# EAGLE schematic retrostoneH3-18 (EAGLE 7.6.0)

## Sheet 1 of 2
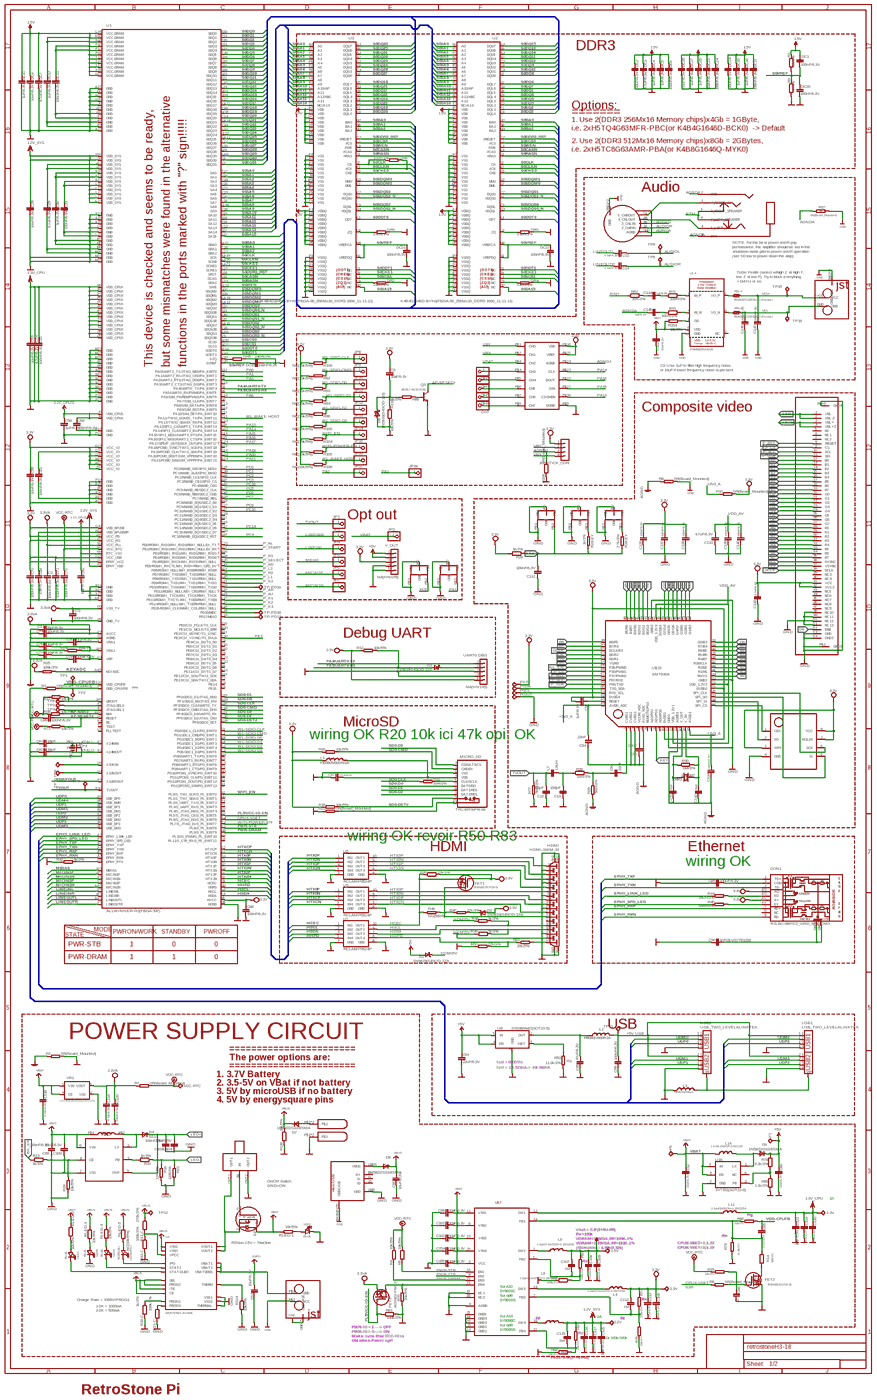
[diagram p0: schematic, sheet 1, overview]
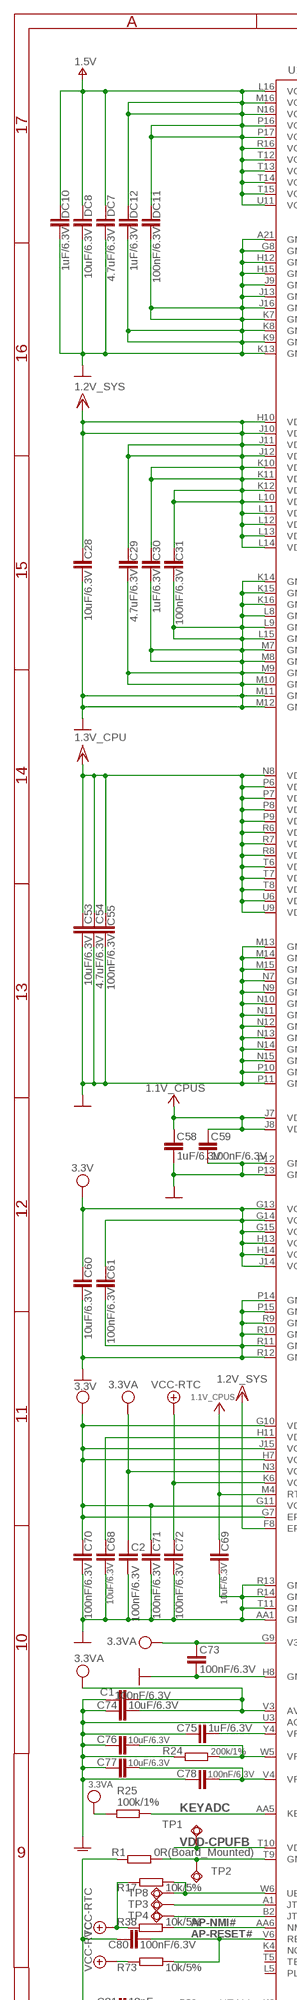
[diagram p1: schematic, sheet 1, part 1 of 4]
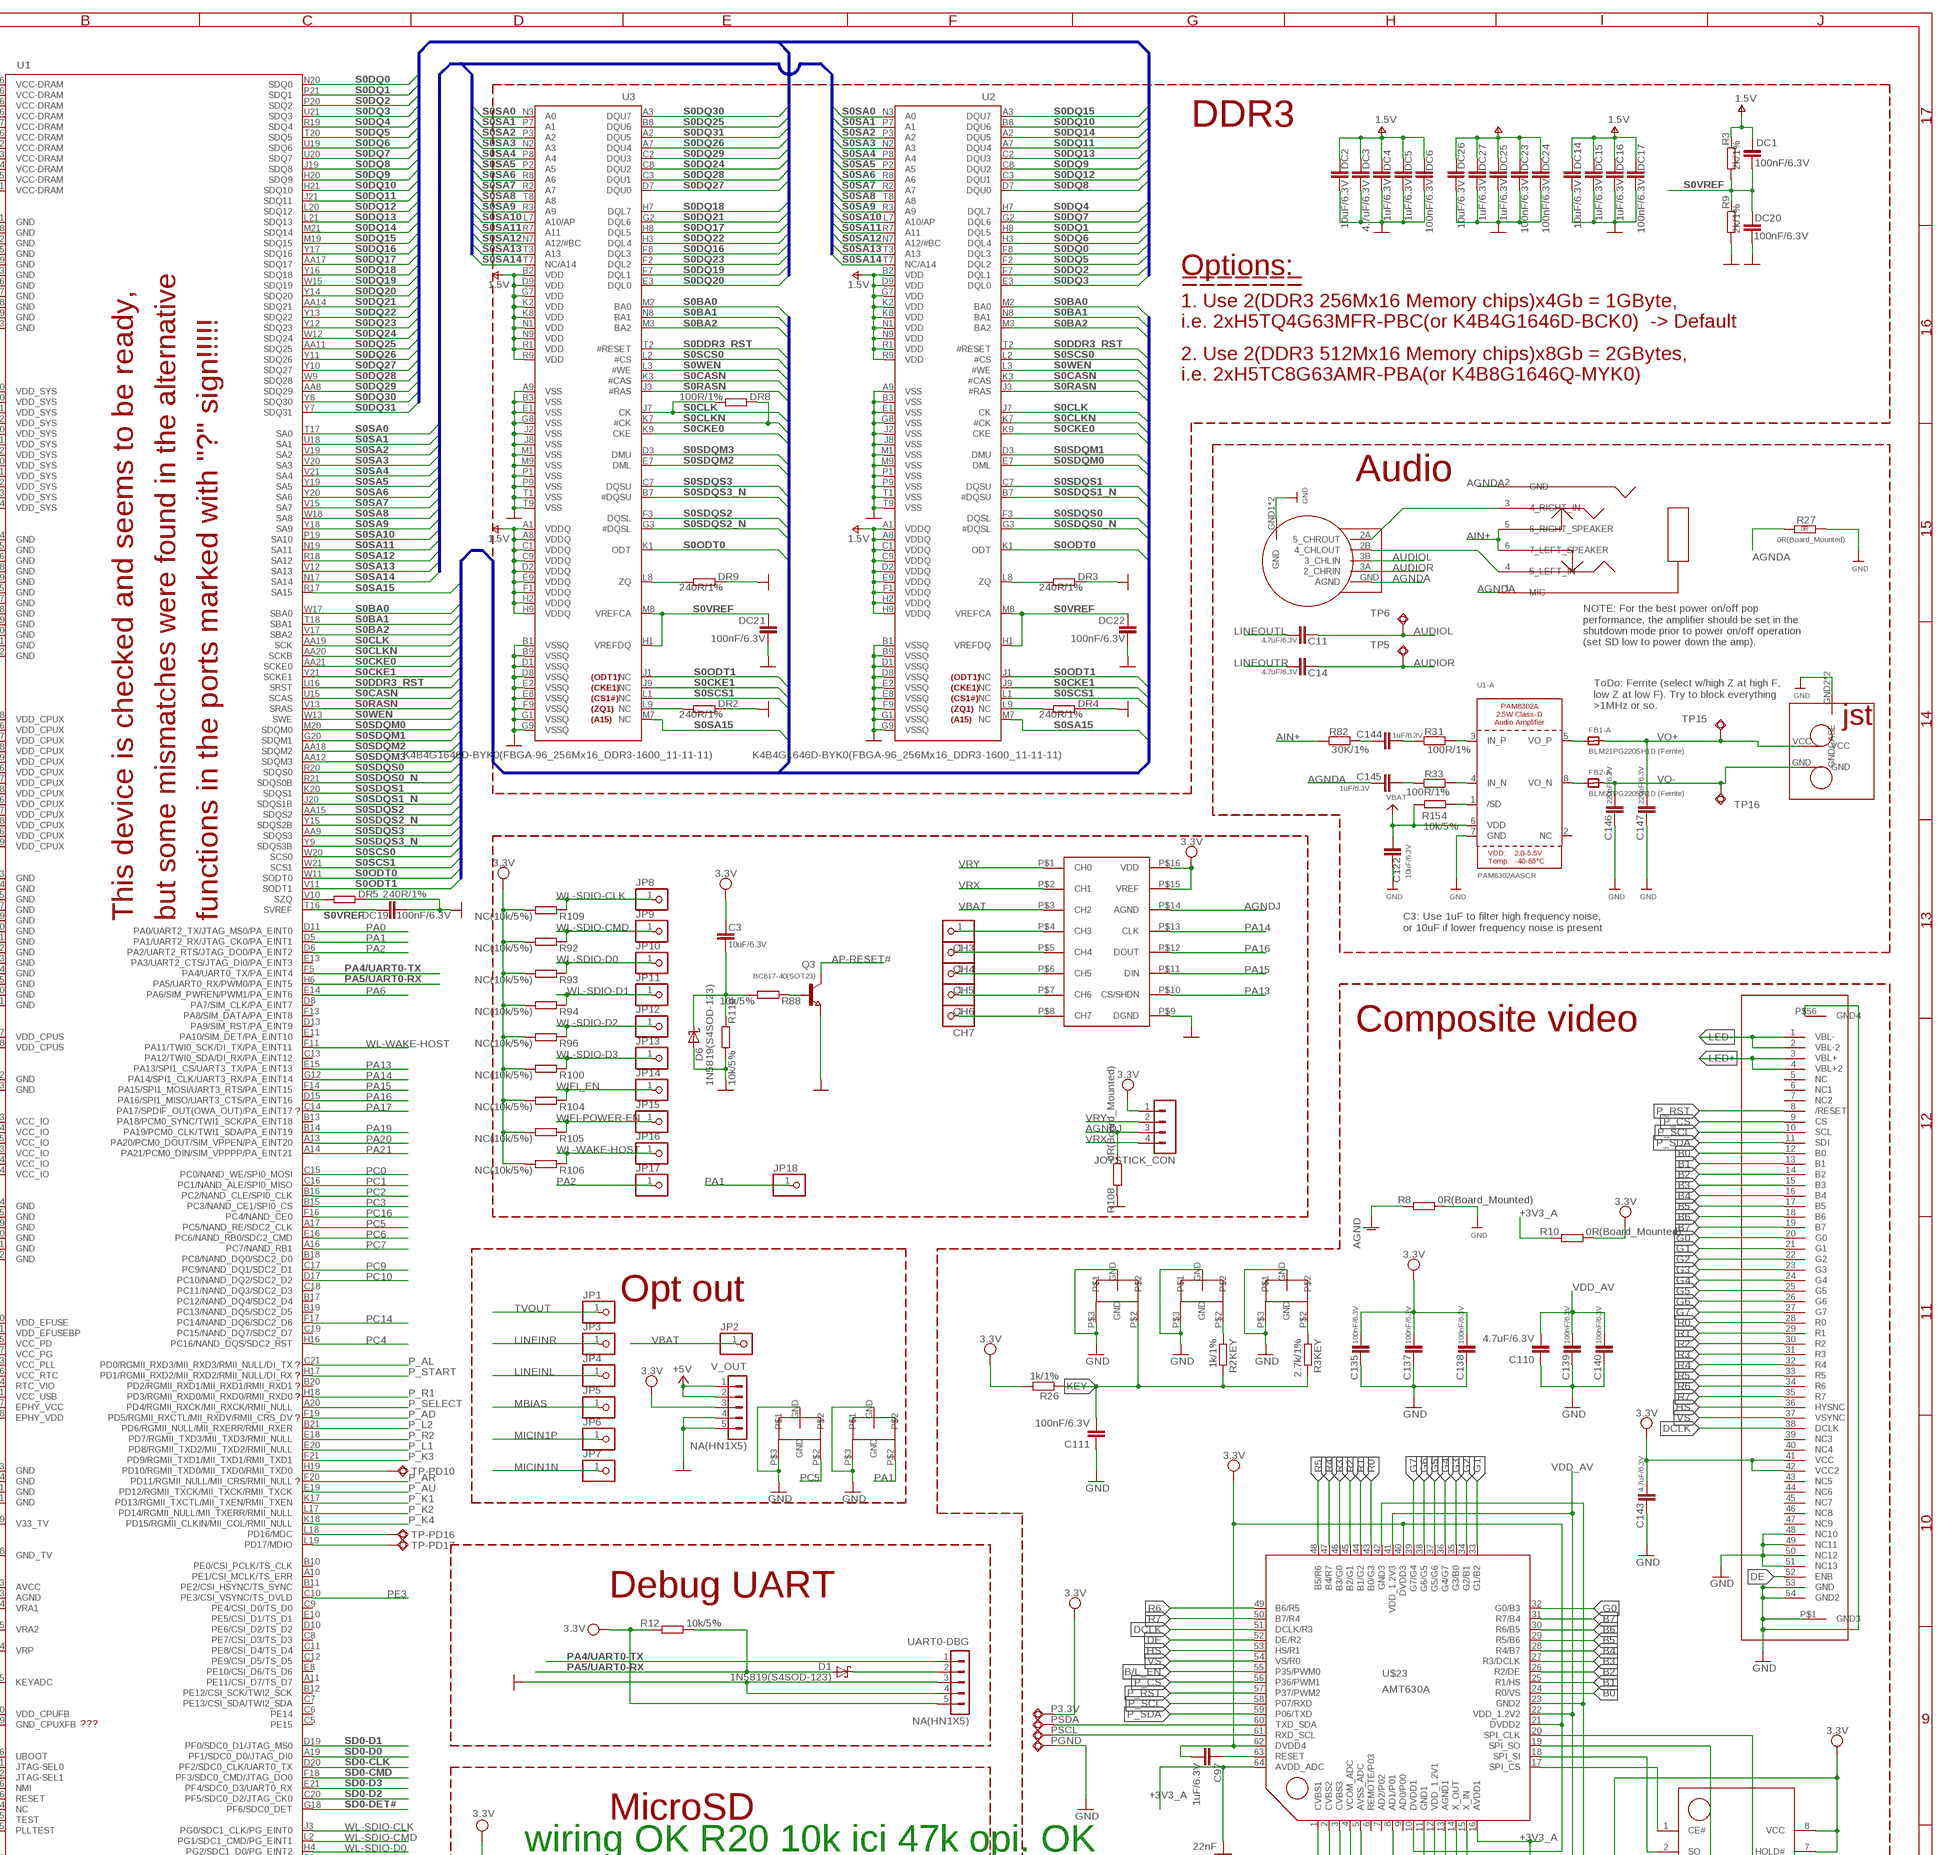
[diagram p2: schematic, sheet 1, part 2 of 4]
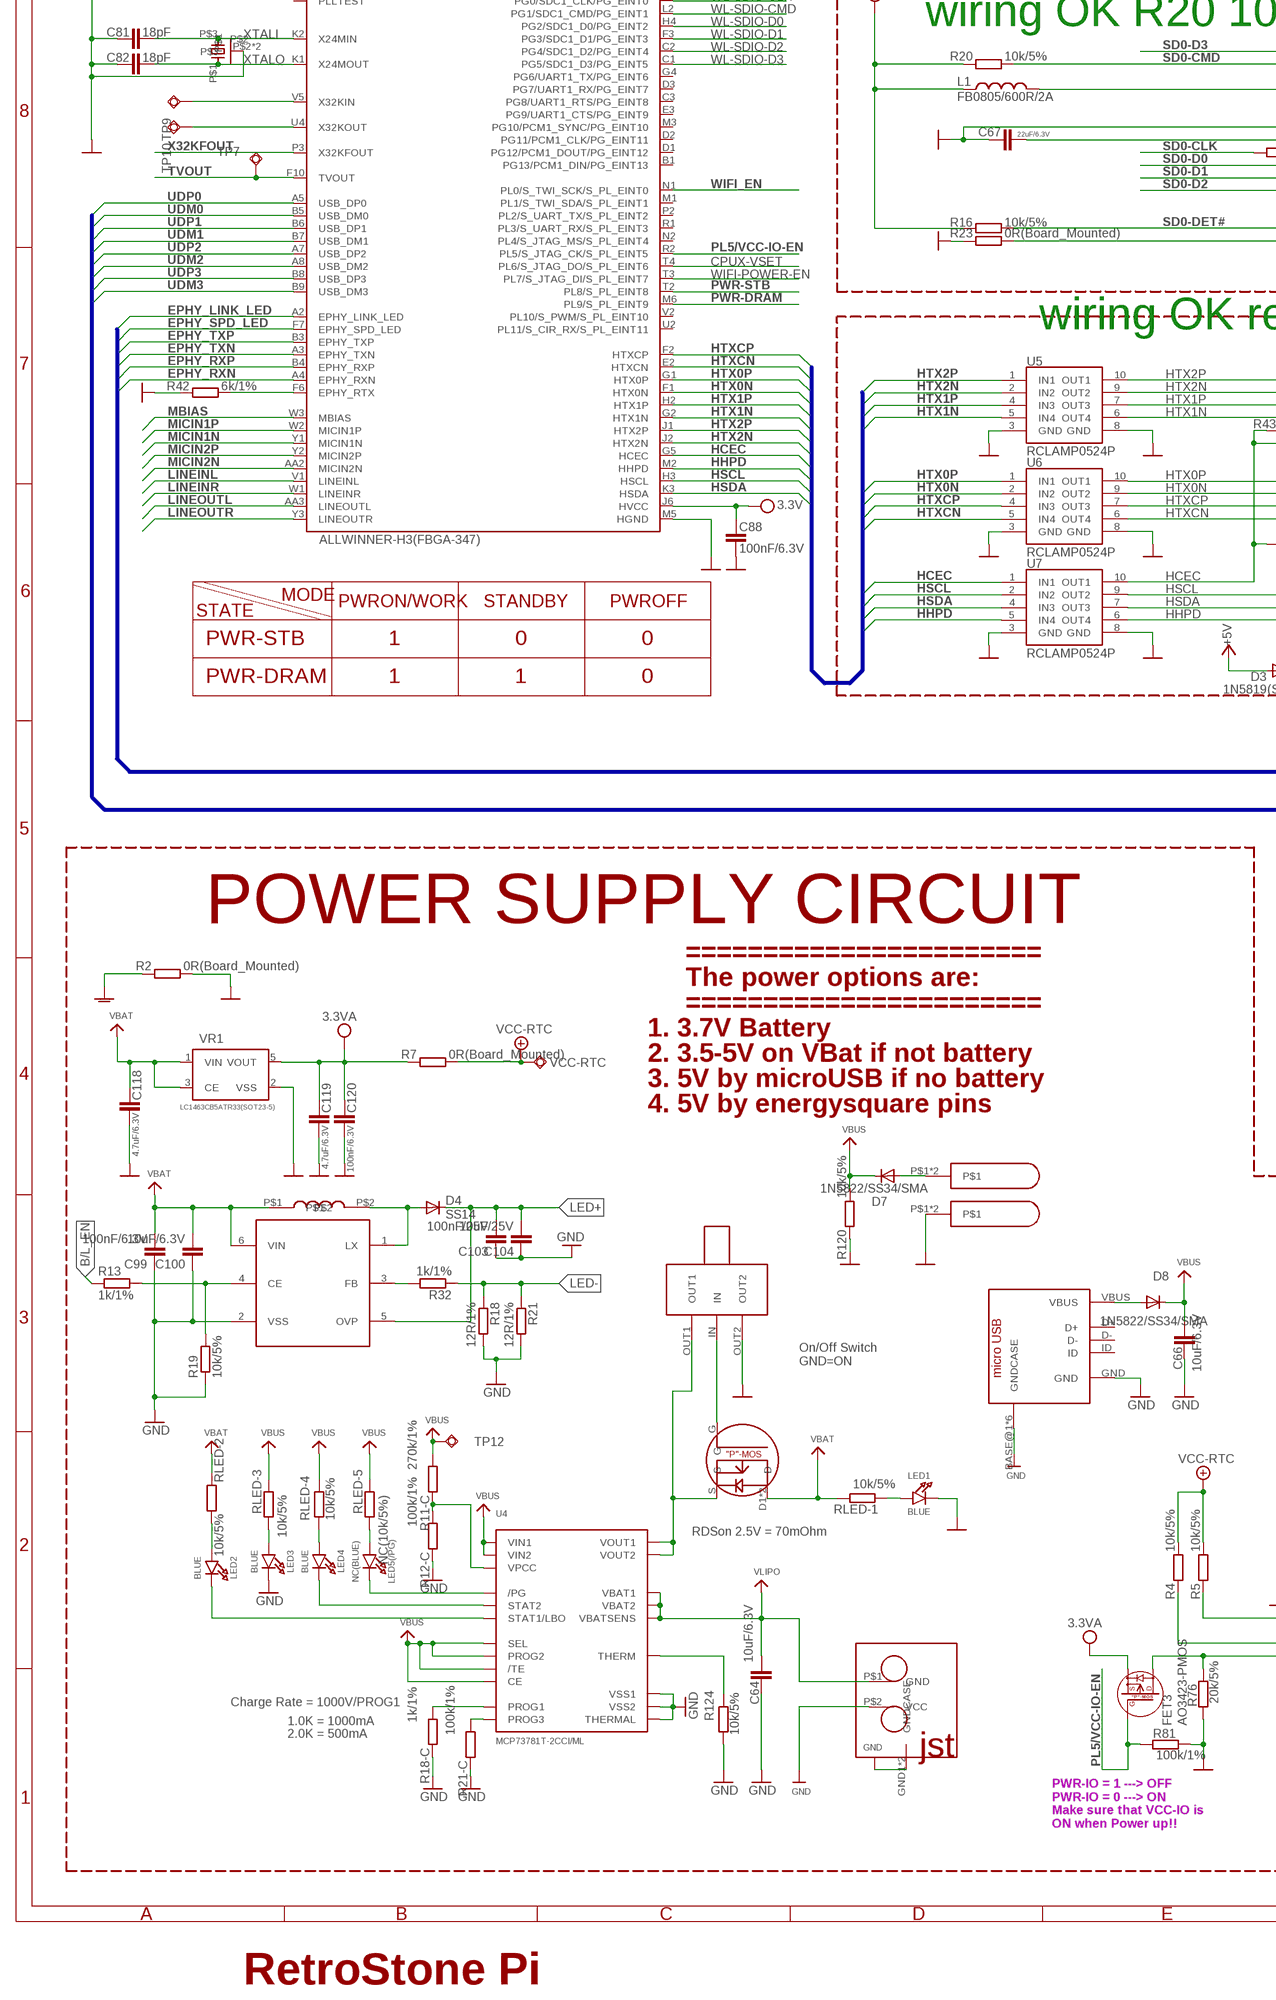
[diagram p3: schematic, sheet 1, part 3 of 4]
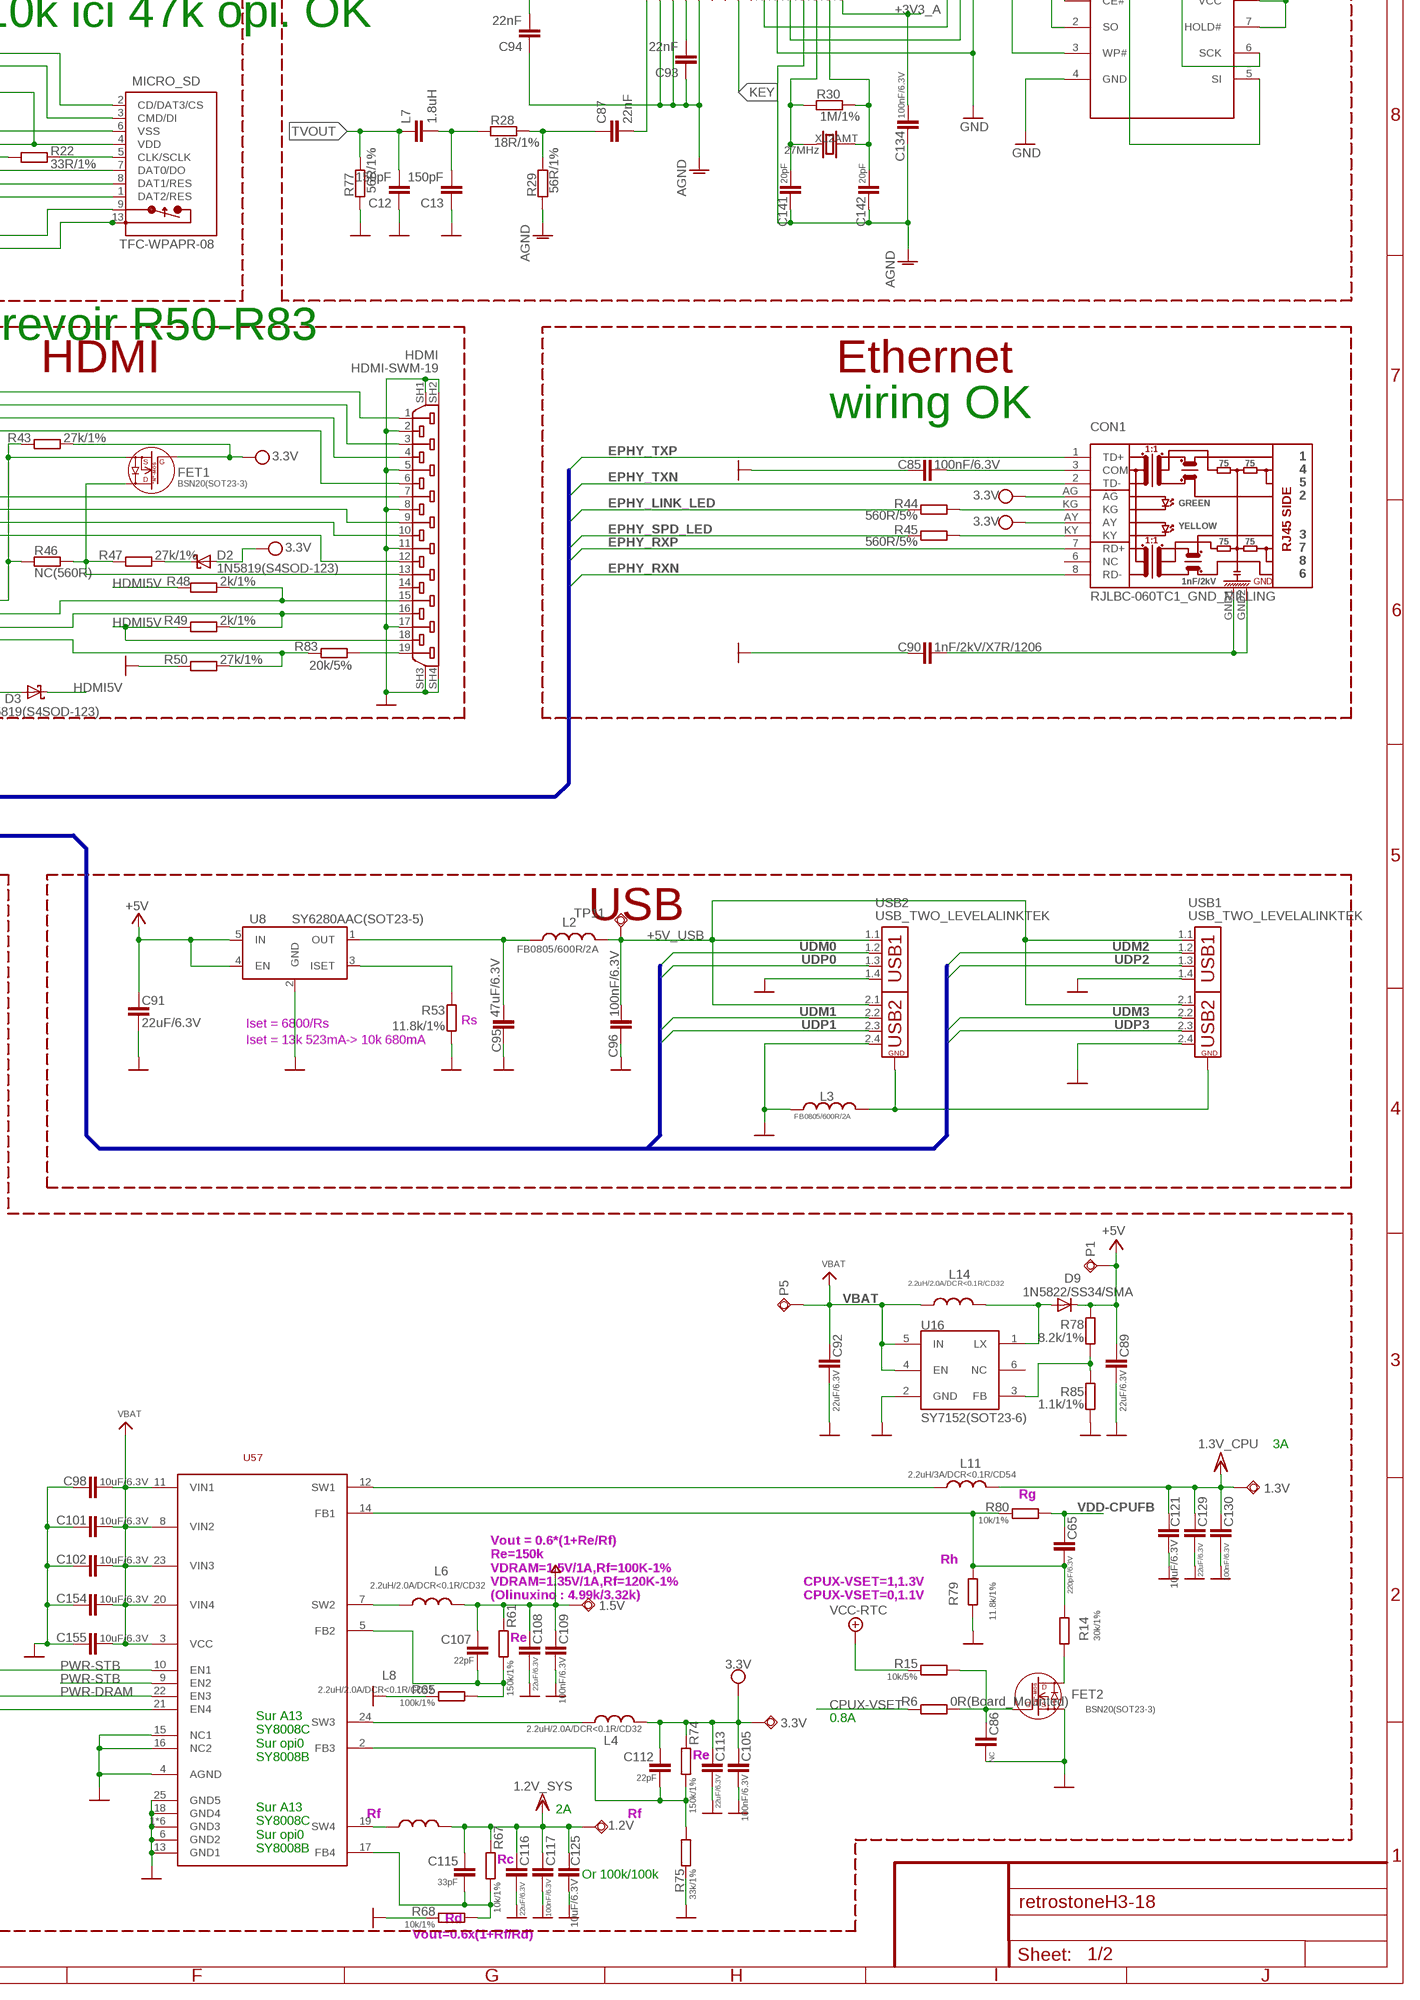
[diagram p4: schematic, sheet 1, part 4 of 4]

### Parts
1.2V  TESTPADTESTPAD_40-ROUND  [TESTPAD_40-ROUND]
1.3V  TESTPADTESTPAD_40-ROUND  [TESTPAD_40-ROUND]
1.5V  TESTPADTESTPAD_40-ROUND  [TESTPAD_40-ROUND]
3.3V  TESTPADTESTPAD_40-ROUND  [TESTPAD_40-ROUND]
C1  100nF/6.3V  C-EUC0402_TI  [C0402_TI]
C2  100nF/6.3V  C-EUC0402_TI  [C0402_TI]
C3  10uF/6.3V  C-EUC0603_DWS  [C0603_DWS]
C11  4.7uF/6.3V  C-EUC0603_DWS  [C0603_DWS]
C12  150pF  C-EUC0402_TI  [C0402_TI]
C13  150pF  C-EUC0402_TI  [C0402_TI]
C14  4.7uF/6.3V  C-EUC0603_DWS  [C0603_DWS]
C28  10uF/6.3V  C-EUC0603_DWS  [C0603_DWS]
C29  4.7uF/6.3V  C-EUC0603_DWS  [C0603_DWS]
C30  1uF/6.3V  C-EUC0402_TI  [C0402_TI]
C31  100nF/6.3V  C-EUC0402_TI  [C0402_TI]
C53  10uF/6.3V  C-EUC0603_DWS  [C0603_DWS]
C54  4.7uF/6.3V  C-EUC0603_DWS  [C0603_DWS]
C55  100nF/6.3V  C-EUC0402_TI  [C0402_TI]
C58  1uF/6.3V  C-EUC0402_TI  [C0402_TI]
C59  100nF/6.3V  C-EUC0402_TI  [C0402_TI]
C60  10uF/6.3V  C-EUC0603_DWS  [C0603_DWS]
C61  100nF/6.3V  C-EUC0402_TI  [C0402_TI]
C64  10uF/6.3V  C-EUC0603_DWS  [C0603_DWS]
C65  220pF/6.3V  C-EUC0402_TI  [C0402_TI]
C66  10uF/6.3V  C-EUC0603_DWS  [C0603_DWS]
C67  22uF/6.3V  C-EUC0603_DWS  [C0603_DWS]
C68  10uF/6.3V  C-EUC0603_DWS  [C0603_DWS]
C69  10uF/6.3V  C-EUC0603_DWS  [C0603_DWS]
C70  100nF/6.3V  C-EUC0402_TI  [C0402_TI]
C71  100nF/6.3V  C-EUC0402_TI  [C0402_TI]
C72  100nF/6.3V  C-EUC0402_TI  [C0402_TI]
C73  100nF/6.3V  C-EUC0402_TI  [C0402_TI]
C74  10uF/6.3V  C-EUC0603_DWS  [C0603_DWS]
C75  1uF/6.3V  C-EUC0402_TI  [C0402_TI]
C76  10uF/6.3V  C-EUC0603_DWS  [C0603_DWS]
C77  10uF/6.3V  C-EUC0603_DWS  [C0603_DWS]
C78  100nF/6.3V  C-EUC0402_TI  [C0402_TI]
C80  100nF/6.3V  C-EUC0402_TI  [C0402_TI]
C81  18pF  C-EUC0402_TI  [C0402_TI]
C82  18pF  C-EUC0402_TI  [C0402_TI]
C85  100nF/6.3V  C-EUC0402_TI  [C0402_TI]
C86  NC  C-EUC0402_TI  [C0402_TI]
C87  22nF  C-EUC0402_TI  [C0402_TI]
C88  100nF/6.3V  C-EUC0402_TI  [C0402_TI]
C89  22uF/6.3V  C-EUC0603_DWS  [C0603_DWS]
C90  1nF/2kV/X7R/1206  C-EUC1206_5MILS_WS_ISO  [C1206_5MILS_WS_ISO]
C91  22uF/6.3V  C-EUC0603_DWS  [C0603_DWS]
C92  22uF/6.3V  C-EUC0603_DWS  [C0603_DWS]
C93  22nF  C-EUC0402_TI  [C0402_TI]
C94  22nF  C-EUC0402_TI  [C0402_TI]
C95  47uF/6.3V  C-EUC0805_5MIL_DWS  [C0805_5MIL_DWS]
C96  100nF/6.3V  C-EUC0402_TI  [C0402_TI]
C97  1uF/6.3V  C-EUC0402_TI  [C0402_TI]
C98  10uF/6.3V  C-EUC0603_DWS  [C0603_DWS]
C99  100nF/6.3V  C-EUC0402_TI  [C0402_TI]
C100  10uF/6.3V  C-EUC0603_DWS  [C0603_DWS]
C101  10uF/6.3V  C-EUC0603_DWS  [C0603_DWS]
C102  10uF/6.3V  C-EUC0603_DWS  [C0603_DWS]
C103  100nF/25V  C-EUC0805_5MIL  [C0805_5MIL]
C104  10uF/25V  C-EUC0805_5MIL  [C0805_5MIL]
C105  100nF/6.3V  C-EUC0402_TI  [C0402_TI]
C107  22pF  C-EUC0402_TI  [C0402_TI]
C108  22uF/6.3V  C-EUC0603_DWS  [C0603_DWS]
C109  100nF/6.3V  C-EUC0402_TI  [C0402_TI]
C110  4.7uF/6.3V  C-EUC0603_DWS  [C0603_DWS]
C111  100nF/6.3V  C-EUC0402_TI  [C0402_TI]
C112  22pF  C-EUC0402_TI  [C0402_TI]
C113  22uF/6.3V  C-EUC0603_DWS  [C0603_DWS]
C115  33pF  C-EUC0402_TI  [C0402_TI]
C116  22uF/6.3V  C-EUC0603_DWS  [C0603_DWS]
C117  100nF/6.3V  C-EUC0402_TI  [C0402_TI]
C118  4.7uF/6.3V  C-EUC0603_DWS  [C0603_DWS]
C119  4.7uF/6.3V  C-EUC0603_DWS  [C0603_DWS]
C120  100nF/6.3V  C-EUC0402_TI  [C0402_TI]
C121  10uF/6.3V  C-EUC0603_DWS  [C0603_DWS]
C122  10uF/6.3V  C-EUC0603_DWS  [C0603_DWS]
C125  10uF/6.3V  C-EUC0603_DWS  [C0603_DWS]
C129  22uF/6.3V  C-EUC0603_DWS  [C0603_DWS]
C130  100nF/6.3V  C-EUC0402_TI  [C0402_TI]
C134  100nF/6.3V  C-EUC0402_TI  [C0402_TI]
C135  100nF/6.3V  C-EUC0402_TI  [C0402_TI]
C137  100nF/6.3V  C-EUC0402_TI  [C0402_TI]
C138  100nF/6.3V  C-EUC0402_TI  [C0402_TI]
C139  100nF/6.3V  C-EUC0402_TI  [C0402_TI]
C140  100nF/6.3V  C-EUC0402_TI  [C0402_TI]
C141  20pF  C-EUC0402_TI  [C0402_TI]
C142  20pF  C-EUC0402_TI  [C0402_TI]
C143  4.7uF/6.3V  C-EUC0603_DWS  [C0603_DWS]
C144  1uF/6.3V  C-EUC0402_TI  [C0402_TI]
C145  1uF/6.3V  C-EUC0402_TI  [C0402_TI]
C146  220pF/6.3V  C-EUC0402_TI  [C0402_TI]
C147  220pF/6.3V  C-EUC0402_TI  [C0402_TI]
C154  10uF/6.3V  C-EUC0603_DWS  [C0603_DWS]
C155  10uF/6.3V  C-EUC0603_DWS  [C0603_DWS]
CH3  PINHD-1X1  [1X01]
CH4  PINHD-1X1  [1X01]
CH5  PINHD-1X1  [1X01]
CH6  PINHD-1X1  [1X01]
CH7  PINHD-1X1  [1X01]
CON1  RJLBC-060TC1_GND_MILLING  [RJLBC-060TC1_MILLING]
D1  1N5819(S4SOD-123)  SCHOTKKY7.62SS-1N5819(S4SOD-123)  [SOD-123]
D2  1N5819(S4SOD-123)  SCHOTKKY7.62SS-1N5819(S4SOD-123)  [SOD-123]
D3  1N5819(S4SOD-123)  SCHOTKKY7.62SS-1N5819(S4SOD-123)  [SOD-123]
D4  SS14  DIODE-DO214AC  [DO214AC]
D6  1N5819(S4SOD-123)  SCHOTKKY7.62SS-1N5819(S4SOD-123)  [SOD-123]
D7  1N5822/SS34/SMA  D-MLL-41  [MELF-MLL41]
D8  1N5822/SS34/SMA  D-MLL-41  [MELF-MLL41]
D9  1N5822/SS34/SMA  D-MLL-41  [MELF-MLL41]
DC1  100nF/6.3V  C-EUC0402_TI  [C0402_TI]
DC2  10uF/6.3V  C-EUC0603_DWS  [C0603_DWS]
DC3  4.7uF/6.3V  C-EUC0603_DWS  [C0603_DWS]
DC4  1uF/6.3V  C-EUC0402_TI  [C0402_TI]
DC5  1uF/6.3V  C-EUC0402_TI  [C0402_TI]
DC6  100nF/6.3V  C-EUC0402_TI  [C0402_TI]
DC7  4.7uF/6.3V  C-EUC0603_DWS  [C0603_DWS]
DC8  10uF/6.3V  C-EUC0603_DWS  [C0603_DWS]
DC10  1uF/6.3V  C-EUC0402_TI  [C0402_TI]
DC11  100nF/6.3V  C-EUC0402_TI  [C0402_TI]
DC12  1uF/6.3V  C-EUC0402_TI  [C0402_TI]
DC14  10uF/6.3V  C-EUC0603_DWS  [C0603_DWS]
DC15  1uF/6.3V  C-EUC0402_TI  [C0402_TI]
DC16  1uF/6.3V  C-EUC0402_TI  [C0402_TI]
DC17  100nF/6.3V  C-EUC0402_TI  [C0402_TI]
DC19  100nF/6.3V  C-EUC0402_TI  [C0402_TI]
DC20  100nF/6.3V  C-EUC0402_TI  [C0402_TI]
DC21  100nF/6.3V  C-EUC0402_TI  [C0402_TI]
DC22  100nF/6.3V  C-EUC0402_TI  [C0402_TI]
DC23  100nF/6.3V  C-EUC0402_TI  [C0402_TI]
DC24  100nF/6.3V  C-EUC0402_TI  [C0402_TI]
DC25  1uF/6.3V  C-EUC0402_TI  [C0402_TI]
DC26  10uF/6.3V  C-EUC0603_DWS  [C0603_DWS]
DC27  1uF/6.3V  C-EUC0402_TI  [C0402_TI]
DR2  240R/1%  R-EU_R0402_TI  [R0402_TI]
DR3  240R/1%  R-EU_R0402_TI  [R0402_TI]
DR4  240R/1%  R-EU_R0402_TI  [R0402_TI]
DR5  240R/1%  R-EU_R0402_TI  [R0402_TI]
DR8  100R/1%  R-EU_R0402_TI  [R0402_TI]
DR9  240R/1%  R-EU_R0402_TI  [R0402_TI]
ENERGYSQUARE_GND  CONTACTPIN_ENERGYSQUARE1MM  [CONTACTPIN_ENERGYSQUARE_OD_1MM]
ENERGYSQUARE_VBUS  CONTACTPIN_ENERGYSQUARE1MM  [CONTACTPIN_ENERGYSQUARE_OD_1MM]
FB1-A  BLM21PG220SH1D (Ferrite)  FERRITE_0805  [_0805]
FB2-A  BLM21PG220SH1D (Ferrite)  FERRITE_0805  [_0805]
FET1  BSN20(SOT23-3)  N-MOS+DIODBSS138(SOT23-3)  [SOT23]
FET2  BSN20(SOT23-3)  N-MOS+DIODBSS138(SOT23-3)  [SOT23]
FET3  AO3423-PMOS  P-MOS+DIODIRLML6402  [SOT23]
FPC54P  FPC_HAYATO  [FPC_HAYATO]
HDMI  HDMI-SWM-19  HDMI-MC34931HDMI-SWM-19  [HDMI-SWM-19]
JOYSTICK_CON  MA04-1  [MA04-1]
JP1  PINHD-1X1  [1X01]
JP2  PINHD-1X1  [1X01]
JP3  PINHD-1X1  [1X01]
JP4  PINHD-1X1  [1X01]
JP5  PINHD-1X1  [1X01]
JP6  PINHD-1X1  [1X01]
JP7  PINHD-1X1  [1X01]
JP8  PINHD-1X1  [1X01]
JP9  PINHD-1X1  [1X01]
JP10  PINHD-1X1  [1X01]
JP11  PINHD-1X1  [1X01]
JP12  PINHD-1X1  [1X01]
JP13  PINHD-1X1  [1X01]
JP14  PINHD-1X1  [1X01]
JP15  PINHD-1X1  [1X01]
JP16  PINHD-1X1  [1X01]
JP17  PINHD-1X1  [1X01]
JP18  PINHD-1X1  [1X01]
L1  FB0805/600R/2A  L-USL0805_5MIL_DWS  [L0805_5MIL_DWS]
L2  FB0805/600R/2A  L-USL0805_5MIL_DWS  [L0805_5MIL_DWS]
L3  FB0805/600R/2A  L-USL0805_5MIL_DWS  [L0805_5MIL_DWS]
L4  2.2uH/2.0A/DCR<0.1R/CD32  L-CD32  [CD32]
L5  22uH/CD32  CD32_INDUCTOR  [CD32_INDUCTOR]
L6  2.2uH/2.0A/DCR<0.1R/CD32  L-CD32  [CD32]
L7  1.8uH  C-EUC0402_TI  [C0402_TI]
L8  2.2uH/2.0A/DCR<0.1R/CD32  L-CD32  [CD32]
L11  2.2uH/3A/DCR<0.1R/CD54  L-CD52(53)  [CD52(53)]
L14  2.2uH/2.0A/DCR<0.1R/CD32  L-CD32  [CD32]
LED1  BLUE  LED0805_NOOUTLINE  [CHIPLED_0805_NOOUTLINE]
LED2  BLUE  LED0805_NOOUTLINE  [CHIPLED_0805_NOOUTLINE]
LED3  BLUE  LED0805_NOOUTLINE  [CHIPLED_0805_NOOUTLINE]
LED4  BLUE  LED0805_NOOUTLINE  [CHIPLED_0805_NOOUTLINE]
LED5(/PG)  NC(BLUE)  LED0805_NOOUTLINE  [CHIPLED_0805_NOOUTLINE]
MICRO_SD  TFC-WPAPR-08  MICRO_SD/MMC_CP_NEWTFC-WPAPR-08  [TFC-WPAPR-08]
P1  TESTPADTESTPAD_40-ROUND  [TESTPAD_40-ROUND]
P3.3V  TESTPADTESTPAD_40-ROUND  [TESTPAD_40-ROUND]
P5  TESTPADTESTPAD_40-ROUND  [TESTPAD_40-ROUND]
PGND  TESTPADTESTPAD_40-ROUND  [TESTPAD_40-ROUND]
PSCL  TESTPADTESTPAD_40-ROUND  [TESTPAD_40-ROUND]
PSDA  TESTPADTESTPAD_40-ROUND  [TESTPAD_40-ROUND]
Q1  24MHz 9pF TSX-3225  TSX-3225  [TSX-3225]
Q3  BC817-40(SOT23)  NPN-TRANSISTOR_SOT23  [SOT23]
R1  0R(Board_Mounted)  R-EU_R0402_TI_0R  [R0402_TI_0R]
R2  0R(Board_Mounted)  R-EU_R0402_TI_0R  [R0402_TI_0R]
R2KEY  1k/1%  R-EU_R0402_TI  [R0402_TI]
R3  2k/1%  R-EU_R0402_TI  [R0402_TI]
R3KEY  2.7k/1%  R-EU_R0402_TI  [R0402_TI]
R4  10k/5%  R-EU_R0402_TI  [R0402_TI]
R5  10k/5%  R-EU_R0402_TI  [R0402_TI]
R6  0R(Board_Mounted)  R-EU_R0402_TI_0R  [R0402_TI_0R]
R7  0R(Board_Mounted)  R-EU_R0402_TI_0R  [R0402_TI_0R]
R8  0R(Board_Mounted)  R-EU_R0402_TI_0R  [R0402_TI_0R]
R9  2k/1%  R-EU_R0402_TI  [R0402_TI]
R10  0R(Board_Mounted)  R-EU_R0402_TI_0R  [R0402_TI_0R]
R11-C  270k/1%  R-EU_R0402_TI  [R0402_TI]
R12  10k/5%  R-EU_R0402_TI  [R0402_TI]
R12-C  100k/1%  R-EU_R0402_TI  [R0402_TI]
R13  1k/1%  R-EU_R0402_TI  [R0402_TI]
R14  30k/1%  R-EU_R0402_TI  [R0402_TI]
R15  10k/5%  R-EU_R0402_TI  [R0402_TI]
R16  10k/5%  R-EU_R0402_TI  [R0402_TI]
R17  10k/5%  R-EU_R0402_TI  [R0402_TI]
R18  12R/1%  R-EU_R0603_5MIL_DWS  [R0603_5MIL_DWS]
R18-C  1k/1%  R-EU_R0402_TI  [R0402_TI]
R19  10k/5%  R-EU_R0402_TI  [R0402_TI]
R20  10k/5%  R-EU_R0402_TI  [R0402_TI]
R21  12R/1%  R-EU_R0603_5MIL_DWS  [R0603_5MIL_DWS]
R21-C  100k/1%  R-EU_R0402_TI  [R0402_TI]
R22  33R/1%  R-EU_R0402_TI  [R0402_TI]
R23  0R(Board_Mounted)  R-EU_R0402_TI_0R  [R0402_TI_0R]
R24  200k/1%  R-EU_R0402_TI  [R0402_TI]
R25  100k/1%  R-EU_R0402_TI  [R0402_TI]
R26  1k/1%  R-EU_R0402_TI  [R0402_TI]
R27  0R(Board_Mounted)  R_0R0R(NA)  [0603_0R]
R28  18R/1%  R-EU_R0402_TI  [R0402_TI]
R29  56R/1%  R-EU_R0402_TI  [R0402_TI]
R30  1M/1%  R-EU_R0402_TI  [R0402_TI]
R31  100R/1%  R-EU_R0402_TI  [R0402_TI]
R32  1k/1%  R-EU_R0402_TI  [R0402_TI]
R33  100R/1%  R-EU_R0402_TI  [R0402_TI]
R38  10k/5%  R-EU_R0402_TI  [R0402_TI]
R42  6k/1%  R-EU_R0402_TI  [R0402_TI]
R43  27k/1%  R-EU_R0603_5MIL_DWS  [R0603_5MIL_DWS]
R44  560R/5%  R-EU_R0603_5MIL_DWS  [R0603_5MIL_DWS]
R45  560R/5%  R-EU_R0603_5MIL_DWS  [R0603_5MIL_DWS]
R46  NC(560R)  R-EU_R0603_5MIL_DWS  [R0603_5MIL_DWS]
R47  27k/1%  R-EU_R0603_5MIL_DWS  [R0603_5MIL_DWS]
R48  2k/1%  R-EU_R0402_TI  [R0402_TI]
R49  2k/1%  R-EU_R0402_TI  [R0402_TI]
R50  27k/1%  R-EU_R0603_5MIL_DWS  [R0603_5MIL_DWS]
R53  11.8k/1%  R-EU_R0402_TI  [R0402_TI]
R61  150k/1%  R-EU_R0402_TI  [R0402_TI]
R65  100k/1%  R-EU_R0402_TI  [R0402_TI]
R67  10k/1%  R-EU_R0402_TI  [R0402_TI]
R68  10k/1%  R-EU_R0402_TI  [R0402_TI]
R73  10k/5%  R-EU_R0402_TI  [R0402_TI]
R74  150k/1%  R-EU_R0402_TI  [R0402_TI]
R75  33k/1%  R-EU_R0402_TI  [R0402_TI]
R76  20k/5%  R-EU_R0402_TI  [R0402_TI]
R77  56R/1%  R-EU_R0402_TI  [R0402_TI]
R78  8.2k/1%  R-EU_R0402_TI  [R0402_TI]
R79  11.8k/1%  R-EU_R0402_TI  [R0402_TI]
R80  10k/1%  R-EU_R0402_TI  [R0402_TI]
R81  100k/1%  R-EU_R0402_TI  [R0402_TI]
R82  30K/1%  R-EU_R0402_TI  [R0402_TI]
R83  20k/5%  R-EU_R0402_TI  [R0402_TI]
R85  1.1k/1%  R-EU_R0402_TI  [R0402_TI]
R88  10k/5%  R-EU_R0402_TI  [R0402_TI]
R92  NC(10k/5%)  R-EU_R0402_TI  [R0402_TI]
R93  NC(10k/5%)  R-EU_R0402_TI  [R0402_TI]
R94  NC(10k/5%)  R-EU_R0402_TI  [R0402_TI]
R96  NC(10k/5%)  R-EU_R0402_TI  [R0402_TI]
R100  NC(10k/5%)  R-EU_R0402_TI  [R0402_TI]
R104  NC(10k/5%)  R-EU_R0402_TI  [R0402_TI]
R105  NC(10k/5%)  R-EU_R0402_TI  [R0402_TI]
R106  NC(10k/5%)  R-EU_R0402_TI  [R0402_TI]
R108  0R(Board_Mounted)  R-EU_R0402_TI_0R  [R0402_TI_0R]
R109  NC(10k/5%)  R-EU_R0402_TI  [R0402_TI]
R110  10k/5%  R-EU_R0402_TI  [R0402_TI]
R120  10k/5%  R-EU_R0402_TI  [R0402_TI]
R124  10k/5%  R-EU_R0402_TI  [R0402_TI]
R154  10k/5%  R-EU_R0402_TI  [R0402_TI]
RLED-1  10k/5%  R-EU_R0402_TI  [R0402_TI]
RLED-2  10k/5%  R-EU_R0402_TI  [R0402_TI]
RLED-3  10k/5%  R-EU_R0402_TI  [R0402_TI]
RLED-4  10k/5%  R-EU_R0402_TI  [R0402_TI]
RLED-5  NC(10k/5%)  R-EU_R0402_TI  [R0402_TI]
TP1  TESTPADTESTPAD_40-ROUND  [TESTPAD_40-ROUND]
TP2  TESTPADTESTPAD_40-ROUND  [TESTPAD_40-ROUND]
TP3  TESTPADTESTPAD_40-ROUND  [TESTPAD_40-ROUND]
TP4  TESTPADTESTPAD_40-ROUND  [TESTPAD_40-ROUND]
TP5  TESTPADTESTPAD_40-ROUND  [TESTPAD_40-ROUND]
TP6  TESTPADTESTPAD_40-ROUND  [TESTPAD_40-ROUND]
TP7  TESTPADTESTPAD_40-ROUND  [TESTPAD_40-ROUND]
TP8  TESTPADTESTPAD_40-ROUND  [TESTPAD_40-ROUND]
TP9  TESTPADTESTPAD_40-ROUND  [TESTPAD_40-ROUND]
TP10  TESTPADTESTPAD_40-ROUND  [TESTPAD_40-ROUND]
TP11  TESTPADTESTPAD_40-ROUND  [TESTPAD_40-ROUND]
TP12  TESTPADTESTPAD_40-ROUND  [TESTPAD_40-ROUND]
TP15  TESTPADTESTPAD_40-ROUND  [TESTPAD_40-ROUND]
TP16  TESTPADTESTPAD_40-ROUND  [TESTPAD_40-ROUND]
TP-PD10  TESTPADTESTPAD_40-ROUND  [TESTPAD_40-ROUND]
TP-PD16  TESTPADTESTPAD_40-ROUND  [TESTPAD_40-ROUND]
TP-PD17  TESTPADTESTPAD_40-ROUND  [TESTPAD_40-ROUND]
U1  ALLWINNER-H3(FBGA-347)  [FBGA-347]
U1-A  PAM8302AASCR  AUDIOAMP_PAM8302A  [MSOP8_0.65MM]
U2  K4B4G1646D-BYK0(FBGA-96_256Mx16_DDR3-1600_11-11-11)  H5TQ2G63BFR_MEM4G16D3EABG-125--H5TC8G63AMR-PBA_K4B8G1646Q-MYK0(FBGA-96_512MX16_DDR3-1600_11-11-11)  [FBGA96(HYNIX_SAMSUNG_512MX16_DDR3)]
U3  K4B4G1646D-BYK0(FBGA-96_256Mx16_DDR3-1600_11-11-11)  H5TQ2G63BFR_MEM4G16D3EABG-125--H5TC8G63AMR-PBA_K4B8G1646Q-MYK0(FBGA-96_512MX16_DDR3-1600_11-11-11)  [FBGA96(HYNIX_SAMSUNG_512MX16_DDR3)]
U4  MCP73781T-2CCI/ML  MCP73871  [QFN20_4MM]
U5  RCLAMP0524P  [SLP2510P8]
U6  RCLAMP0524P  [SLP2510P8]
U7  RCLAMP0524P  [SLP2510P8]
U8  SY6280AAC(SOT23-5)  SY6280  [SOT23-5]
U16  SY7152(SOT23-6)  SY7208  [SOT23-6]
U57  AXP8036  [QFN4X4]
U$6  SS-12F21(1P2T)  [SS-12F21(1P2T)]
U$8  JST_PH_VERT_2P  [JST_PH_VERT_2P]
U$11  CSD22205L  [CSD22205L]
U$14  KA2707  [SOT23-6]
U$15  TACT_SWITCH_HORIZONTAL  [TACT_SWITCH_HORIZONTAL]
U$17  MICROUSB_HAYATO  [MICROUSB_HAYATO]
U$18  PM25LV512  [SOIC8]
U$23  AMT630A  [LQFP-ST-64-2]
U$24  PJ342_5PIN  [PJ342_6P]
U$27  WHEEL_POT  [WHEEL_POT]
U$29  JST2_HAYATO  [JST2_HAYATO]
U$33  NC/(TACT_SWITCH_HORIZONTAL)  TACT_SWITCH_HORIZONTAL  [TACT_SWITCH_HORIZONTAL]
U$35  MCP3208  [MCP3208]
U$36  TACT_SWITCH_HORIZONTAL  [TACT_SWITCH_HORIZONTAL]
U$37  TACT_SWITCH_HORIZONTAL  [TACT_SWITCH_HORIZONTAL]
U$38  TACT_SWITCH_HORIZONTAL  [TACT_SWITCH_HORIZONTAL]
UART0-DBG  NA(HN1X5)  CON5HN1X5  [HN1X5]
USB1  USB_TWO_LEVELALINKTEK  [USB_TWO_LEVEL_ALINKTEK]
USB2  USB_TWO_LEVELALINKTEK  [USB_TWO_LEVEL_ALINKTEK]
V_OUT  NA(HN1X5)  CON5HN1X5  [HN1X5]
VCC-RTC  TESTPADTESTPAD_40-ROUND  [TESTPAD_40-ROUND]
VR1  LC1463CB5ATR33(SOT23-5)  AP1231-33  [SOT-23-5]
XL2AMT  27MHz  CRYSTALHC49UP  [HC49UP]

### Nets
+3V3_A: C94.2 C134.2 R10.2 U$23.16(AVDD1) U$23.64(AVDD_ADC)
+5V: C89.1 C91.1 D3.A D9.1(C) P1.1(PP) R78.2 U8.4(EN) U8.5(IN) V_OUT.1 V_OUT.2
+5V_USB: C96.1 L2.1 TP11.1(PP) USB1.1.1 USB1.2.1 USB2.1.1 USB2.2.1
+7V: C72.2 R4.1 R5.1 R7.1 R15.1 R17.1 R38.2 R73.1 U1.K6(VCC_RTC) VCC-RTC.1(PP) ; supply symbol labelled VCC-RTC
AGND: C93.1 C94.1 C134.1 C141.1 C142.1 R8.2 R29.1 U$23.2(CVBS2) U$23.3(CVBS3) U$23.5(AVSS_ADC) U$23.13(AGND1)
AGNDA: C145.1 R27.2(1.2) U$24.1(MIC) U$24.2(GND) U$27.GND(AGND)
AGNDJ: JOYSTICK_CON.3 R108.1 U$35.P$14(AGND)
AIN+: R82.1 U$24.5(6_RIGHT_SPEAKER) U$24.6(7_LEFT_SPEAKER)
AP-NMI#: R38.1 U1.AA6(NMI)
AP-RESET#: C80.2 Q3.3(C) R73.2 U1.V6(RESET)
AUDIOL: C11.1 TP6.1(PP) U$27.3B(3_CHLIN)
AUDIOR: C14.1 TP5.1(PP) U$27.3A(2_CHRIN)
B0: FPC54P.12(B0) U$23.24(R0/VS)
B1: FPC54P.13(B1) U$23.25(R1/HS)
B2: FPC54P.14(B2) U$23.26(R2/DE)
B3: FPC54P.15(B3) U$23.27(R3/DCLK)
B4: FPC54P.16(B4) U$23.28(R4/B7)
B5: FPC54P.17(B5) U$23.29(R5/B6)
B6: FPC54P.18(B6) U$23.30(R6/B5)
B7: FPC54P.19(B7) U$23.31(R7/B4)
B/L_EN: R13.1 U$23.55(P35/PWM0)
CH3: CH3.1 U$35.P$4(CH3)
CPUX-VSET: R6.2 U1.T4(PL6/S_JTAG_DO/S_PL_EINT6)
DCLK: FPC54P.38(DCLK) U$23.51(DCLK/R3)
DE: FPC54P.52(ENB) U$23.52(DE/R2)
ENABLE: U$6.IN U$11.G
EPHY_LINK_LED: R44.2 U1.A2(EPHY_LINK_LED)
EPHY_RXN: CON1.8(RD-) U1.A4(EPHY_RXN)
EPHY_RXP: CON1.7(RD+) U1.B4(EPHY_RXP)
EPHY_SPD_LED: R45.2 U1.F7(EPHY_SPD_LED)
EPHY_TXN: CON1.2(TD-) U1.A3(EPHY_TXN)
EPHY_TXP: CON1.1(TD+) U1.B3(EPHY_TXP)
G0: FPC54P.20(G0) U$23.32(G0/B3)
G1: FPC54P.21(G1) U$23.33(G1/B2)
G2: FPC54P.22(G2) U$23.34(G2/B1)
G3: FPC54P.23(G3) U$23.35(G3/B0)
G4: FPC54P.24(G4) U$23.36(G4/G7)
G5: FPC54P.25(G5) U$23.37(G5/G6)
G6: FPC54P.26(G6) U$23.38(G6/G5)
G7: FPC54P.27(G7) U$23.39(G7/G4)
GND [pwr]: C2.1 C12.1 C13.1 C28.2 C29.1 C30.1 C31.1 C53.2 C54.2 C55.1 C58.2 C59.1 C60.2 C61.1 C64.1 C66.1 C67.1 C68.2 C69.2 C70.1 C71.1 C72.1 C73.1 C80.1 C81.1 C82.1 C85.1 C86.2 C88.1 C89.2 C90.1 C91.2 C92.1 C95.2 C96.2 C98.1 C99.1 C100.1 C101.1 C102.1 C103.1 C104.1 C105.2 C108.2 C109.2 C110.1 C111.1 C113.2 C116.2 C117.2 C118.2 C119.2 C120.2 C121.1 C122.1 C125.1 C129.2 C130.2 C135.1 C137.1 C138.1 C139.1 C140.1 C143.1 C146.1 C147.1 C154.1 C155.1 D6.A DC2.2 DC3.2 DC4.1 DC5.1 DC6.1 DC7.2 DC8.2 DC10.1 DC11.1 DC12.1 DC14.2 DC15.1 DC16.1 DC17.1 DC19.1 DC20.1 DC21.1 DC22.1 DC23.1 DC24.1 DC25.1 DC26.2 DC27.1 DR2.1 DR3.1 DR4.1 DR5.1 DR9.1 ENERGYSQUARE_GND.P$1 ENERGYSQUARE_GND.P$2 FET2.2(S) FPC54P.48(NC10) FPC54P.49(NC11) FPC54P.50(NC12) FPC54P.51(NC13) FPC54P.53(GND) FPC54P.54(GND2) FPC54P.P$1(GND3) FPC54P.P$56(GND4) HDMI.2 HDMI.5 HDMI.8 HDMI.11 HDMI.17 HDMI.SH1 HDMI.SH2 HDMI.SH3 HDMI.SH4 L3.1 LED1.C LED3.C MICRO_SD.6(VSS) PGND.1(PP) Q1.P$2 Q1.P$4 Q3.2(E) R1.2 R2.1 R8.1 R9.2 R12-C.2 R18-C.2 R18.2 R19.1 R21-C.2 R21.2 R23.2 R27.1(1.1) R42.2 R50.2 R53.1 R65.2 R68.2 R75.2 R76.1 R77.1 R79.2 R81.2 R85.2 R108.2 R110.1 R120.2 R124.2 U1-A.7(GND) U1.A21(GND) U1.AA1(GND) U1.G8(GND) U1.H8(GND_TV) U1.H12(GND) U1.H15(GND) U1.J9(GND) U1.J13(GND) U1.J16(GND) U1.K7(GND) U1.K8(GND) U1.K9(GND) U1.K13(GND) U1.K14(GND) U1.K15(GND) U1.K16(GND) U1.L8(GND) U1.L9(GND) U1.L15(GND) U1.M5(HGND) U1.M7(GND) U1.M8(GND) U1.M9(GND) U1.M10(GND) U1.M11(GND) U1.M12(GND) U1.M13(GND) U1.M14(GND) U1.M15(GND) U1.N7(GND) U1.N9(GND) U1.N10(GND) U1.N11(GND) U1.N12(GND) U1.N13(GND) U1.N14(GND) U1.N15(GND) U1.P10(GND) U1.P11(GND) U1.P12(GND) U1.P13(GND) U1.P14(GND) U1.P15(GND) U1.R9(GND) U1.R10(GND) U1.R11(GND) U1.R12(GND) U1.R13(GND) U1.R14(GND) U1.T11(GND) U2.A9(VSS) U2.B1(VSSQ) U2.B3(VSS) U2.B9(VSSQ) U2.D1(VSSQ) U2.D8(VSSQ) U2.E1(VSS) U2.E2(VSSQ) U2.E8(VSSQ) U2.F9(VSSQ) U2.G1(VSSQ) U2.G8(VSS) U2.G9(VSSQ) U2.J2(VSS) U2.J8(VSS) U2.M1(VSS) U2.M9(VSS) U2.P1(VSS) U2.P9(VSS) U2.T1(VSS) U2.T9(VSS) U3.A9(VSS) U3.B1(VSSQ) U3.B3(VSS) U3.B9(VSSQ) U3.D1(VSSQ) U3.D8(VSSQ) U3.E1(VSS) U3.E2(VSSQ) U3.E8(VSSQ) U3.F9(VSSQ) U3.G1(VSSQ) U3.G8(VSS) U3.G9(VSSQ) U3.J2(VSS) U3.J8(VSS) U3.M1(VSS) U3.M9(VSS) U3.P1(VSS) U3.P9(VSS) U3.T1(VSS) U3.T9(VSS) U4.P$10(VSS1) U4.P$11(VSS2) U4.P$21(THERMAL) U5.3(GND) U5.8(GND) U6.3(GND) U6.8(GND) U7.3(GND) U7.8(GND) U8.2(GND) U16.2(GND) U57.1(GND3) U57.4(AGND) U57.6(GND2) U57.13(GND1) U57.15(NC1) U57.16(NC2) U57.18(GND4) U57.25(GND5) U57.P$1(GND3) U57.P$2(GND3) U57.P$3(GND3) U57.P$4(GND3) U57.P$5(GND3) U$6.OUT2 U$8.GND1(GNDCASE) U$8.GND2(GNDCASE) U$8.P$2(VCC) U$14.2(VSS) U$15.GND U$15.P$3 U$17.BASE@1(GNDCASE) U$17.BASE@2(GNDCASE) U$17.GND U$17.P$1(GNDCASE) U$17.P$2(GNDCASE) U$17.SPRT@3(GNDCASE) U$17.SPRT@4(GNDCASE) U$18.4(GND) U$23.11(GND1) U$23.23(GND2) U$23.42(GND3) U$27.GND1(GND) U$27.GND2(GND) U$29.GND2(GNDCASE) U$29.GND3(GNDCASE) U$33.GND U$33.P$3 U$35.P$9(DGND) U$36.GND U$36.P$3 U$37.GND U$37.P$3 U$38.GND U$38.P$3 UART0-DBG.3 UART0-DBG.4 USB1.1.4 USB1.2.4 USB2.1.4 USB2.2.4 V_OUT.4 V_OUT.5 VR1.2(VSS) ; also sheet 2
GNDA: C1.2 C74.1 C75.1 C76.1 C77.1 C78.1 R2.2 R24.2 U1.U3(AGND)
HCEC: FET1.2(S) R43.1 R46.2 U1.G5(HCEC) U7.1(IN1) U7.10(OUT1)
HDMI5V: D3.C HDMI.18 R48.2 R49.2
HHPD: R50.1 R83.1 U1.M2(HHPD) U7.5(IN4) U7.6(OUT4)
HS: FPC54P.36(HYSNC) U$23.53(HS/R1)
HSCL: HDMI.15 R48.1 U1.H3(HSCL) U7.2(IN2) U7.9(OUT2)
HSDA: HDMI.16 R49.1 U1.K3(HSDA) U7.4(IN3) U7.7(OUT3)
HTX0N: HDMI.9 U1.F1(HTX0N) U6.2(IN2) U6.9(OUT2)
HTX0P: HDMI.7 U1.G1(HTX0P) U6.1(IN1) U6.10(OUT1)
HTX1N: HDMI.6 U1.G2(HTX1N) U5.5(IN4) U5.6(OUT4)
HTX1P: HDMI.4 U1.H2(HTX1P) U5.4(IN3) U5.7(OUT3)
HTX2N: HDMI.3 U1.J2(HTX2N) U5.2(IN2) U5.9(OUT2)
HTX2P: HDMI.1 U1.J1(HTX2P) U5.1(IN1) U5.10(OUT1)
HTXCN: HDMI.12 U1.E2(HTXCN) U6.5(IN4) U6.6(OUT4)
HTXCP: HDMI.10 U1.F2(HTXCP) U6.4(IN3) U6.7(OUT3)
KEY: C111.2 R2KEY.2 R3KEY.2 R26.1 U$23.8(AD1/P01) U$36.P$2
KEYADC: R25.1 U1.AA5(KEYADC)
LED+: C103.2 C104.2 D4.C FPC54P.3(VBL+) FPC54P.4(VBL+2) U$14.5(OVP)
LED-: FPC54P.1(VBL-) FPC54P.2(VBL-2) R18.1 R21.1 R32.1
LINEINL: JP4.1 U1.V1(LINEINL)
LINEINR: JP3.1 U1.W1(LINEINR)
LINEOUTL: C11.2 U1.AA3(LINEOUTL)
LINEOUTR: C14.2 U1.Y3(LINEOUTR)
LR: U$24.3(4_RIGHT_IN) U$27.2A(5_CHROUT)
MBIAS: JP5.1 U1.W3(MBIAS)
MICIN1N: JP7.1 U1.Y1(MICIN1N)
MICIN1P: JP6.1 U1.W2(MICIN1P)
MICIN2N: U1.AA2(MICIN2N)
MICIN2P: U1.Y2(MICIN2P)
N$1: MICRO_SD.5(CLK/SCLK) R22.1
N$2: DR5.2 U1.V10(SZQ)
N$3: DR9.2 U3.L8(ZQ)
N$4 [pwr]: D2.C R47.1
N$5: DR3.2 U2.L8(ZQ)
N$6: DR2.2 U3.L9(NC)
N$7: D1.C UART0-DBG.2
N$8 [pwr]: R1.1 TP2.1(PP) U1.T9(GND_CPUXFB)
N$9: L8.1 U57.19(SW4)
N$10: TP4.1(PP) U1.B2(JTAG-SEL1)
N$11: DR4.2 U2.L9(NC)
N$12: FET2.3(D) R14.2
N$13: HDMI.19 R83.2
N$14: C75.2 U1.Y4(VRA1)
N$15: C87.1 R28.2 R29.2
N$16: C87.2 U$23.1(CVBS1)
N$17: C93.2 U$23.4(VCOM_ADC)
N$18: C97.1 U$23.63(RESET)
N$19: U4.P$1(VOUT1) U4.P$20(VOUT2) U$6.OUT1 U$11.S
N$20: R53.2 U8.3(ISET)
N$21: R2KEY.1 U$37.P$2
N$22: R13.2 R19.2 U$14.4(CE)
N$23: D4.A L5.P$2 U$14.1(LX)
N$24: C86.1 FET2.1(G) R6.1 R15.2
N$25: R32.2 U$14.3(FB)
N$26: L6.1 U57.7(SW2)
N$27: C95.1 L2.2 U8.1(OUT)
N$28: FET1.3(D) HDMI.13 R46.1 R47.2
N$29: R17.2 TP8.1(PP) U1.W6(UBOOT)
N$30: LED3.A RLED-3.1
N$31 [pwr]: C90.2 CON1.GND1 CON1.GND2
N$32: LED2.A RLED-2.1
N$33: L11.1 U57.12(SW1)
N$34: TP3.1(PP) U1.A1(JTAG-SEL0)
N$35: LED1.A RLED-1.1
N$36: Q3.1(B) R88.2
N$37: LED4.A RLED-4.2
N$39: L4.1 U57.24(SW3)
N$40: TP10.1(PP) U1.U4(X32KOUT)
N$41: TP9.1(PP) U1.V5(X32KIN)
N$42: C107.2 R61.2 R65.1 U57.5(FB2)
N$43: TP-PD16.1(PP) U1.L18(PD16/MDC)
N$44: C112.2 R74.2 R75.1 U57.2(FB3)
N$45: C3.2 D6.C R88.1 R110.2
N$46 [pwr]: FET3.3(D) R76.2 U57.21(EN4)
N$47: TP-PD17.1(PP) U1.L19(PD17/MDIO)
N$48: C144.1 R82.2
N$49: C115.2 R67.2 R68.1 U57.17(FB4)
N$50: CH4.1 U$35.P$5(CH4)
N$51: R3KEY.1 U$38.P$2
N$52: C65.2 R14.1 R79.1 R80.1 U57.14(FB1)
N$53: CON1.KG R44.1
N$54: TP-PD10.1(PP) U1.H19(PD10/RGMII_TXD0/MII_TXD0/RMII_TXD0)
N$55: R42.1 U1.F6(EPHY_RTX)
N$56: C85.2 CON1.3(COM)
N$57: CON1.KY R45.1
N$58: MICRO_SD.10(PACK1) MICRO_SD.11(PACK2) MICRO_SD.12(PACK3) MICRO_SD.13(PACK4) R23.1
N$59: R11-C.2 R12-C.1 U4.P$2(VPCC)
N$60: LED4.C U4.P$7(STAT2)
N$61: LED2.C U4.P$8(STAT1/LBO)
N$62: R18-C.1 U4.P$13(PROG1)
N$63: R124.1 U4.P$5(THERM)
N$64: R154.2 U1-A.1(/SD)
N$65: LED5(/PG).A RLED-5.1
N$66: R21-C.1 U4.P$12(PROG3)
N$67: LED5(/PG).C U4.P$6(/PG)
N$68: D7.2(A) ENERGYSQUARE_VBUS.P$1 ENERGYSQUARE_VBUS.P$2
N$69: C13.2 L7.2 R28.1
N$70: R33.2 U1-A.4(IN_N)
N$71: R31.2 U1-A.3(IN_P)
N$72: C145.2 R33.1
N$73: FB2-A.1 U1-A.8(VO_N)
N$74: FB1-A.1 U1-A.5(VO_P)
N$75: C144.2 R31.1
N$76: U$24.4(5_LEFT_IN) U$27.2B(4_CHLOUT)
N$79: D8.2(A) U$17.VBUS
N$80: CH5.1 U$35.P$6(CH5)
N$81: CH6.1 U$35.P$7(CH6)
N$84: CH7.1 U$35.P$8(CH7)
N$122: C77.2 C78.2 U1.V4(VRP)
N$123: D9.2(A) L14.2 U16.1(LX)
N$126: R78.1 R85.1 U16.3(FB)
N$176: C76.2 R24.1 U1.W5(VRA2)
N$193: L3.2 USB1.GND1 USB1.GND2(GND1) USB1.GND3(GND1) USB1.GND4(GND1) USB2.GND1 USB2.GND2(GND1) USB2.GND3(GND1) USB2.GND4(GND1)
P_AD: U1.F19(PD5/RGMII_RXCTL/MII_RXDV/RMII_CRS_DV) ; also sheet 2
P_AL: U1.C21(PD0/RGMII_RXD3/MII_RXD3/RMII_NULL/DI_TX) ; also sheet 2
P_AR: U1.F20(PD11/RGMII_NULL/MII_CRS/RMII_NULL) ; also sheet 2
P_AU: U1.E19(PD12/RGMII_TXCK/MII_TXCK/RMII_TXCK) ; also sheet 2
P_CS: FPC54P.9(CS) U$23.56(P36/PWM1)
P_K1: U1.K17(PD13/RGMII_TXCTL/MII_TXEN/RMII_TXEN) ; also sheet 2
P_K2: U1.L17(PD14/RGMII_NULL/MII_TXERR/RMII_NULL) ; also sheet 2
P_K3: U1.F21(PD9/RGMII_TXD1/MII_TXD1/RMII_TXD1) ; also sheet 2
P_K4: U1.K18(PD15/RGMII_CLKIN/MII_COL/RMII_NULL) ; also sheet 2
P_L1: U1.E20(PD8/RGMII_TXD2/MII_TXD2/RMII_NULL) ; also sheet 2
P_L2: U1.B21(PD6/RGMII_NULL/MII_RXERR/RMII_RXER) ; also sheet 2
P_R1: U1.H18(PD3/RGMII_RXD0/MII_RXD0/RMII_RXD0) ; also sheet 2
P_R2: U1.E18(PD7/RGMII_TXD3/MII_TXD3/RMII_NULL) ; also sheet 2
P_RST: FPC54P.8(/RESET) U$23.57(P37/PWM2)
P_SCL: FPC54P.10(SCL) U$23.58(P07/RXD)
P_SDA: FPC54P.11(SDI) U$23.59(P06/TXD)
P_SELECT: U1.A20(PD4/RGMII_RXCK/MII_RXCK/RMII_NULL) ; also sheet 2
P_START: U1.H17(PD1/RGMII_RXD2/MII_RXD2/RMII_NULL/DI_RX) ; also sheet 2
PA0: U1.D11(PA0/UART2_TX/JTAG_MS0/PA_EINT0) ; also sheet 2
PA1: JP18.1 U1.D5(PA1/UART2_RX/JTAG_CK0/PA_EINT1) U$15.P$2 ; also sheet 2
PA2: JP17.1 U1.D6(PA2/UART2_RTS/JTAG_DO0/PA_EINT2) ; also sheet 2
PA4/UART0-TX: U1.F5(PA4/UART0_TX/PA_EINT4) UART0-DBG.1
PA5/UART0-RX: D1.A R12.1 U1.H6(PA5/UART0_RX/PWM0/PA_EINT5)
PA6: U1.E14(PA6/SIM_PWREN/PWM1/PA_EINT6) ; also sheet 2
PA13: U1.E15(PA13/SPI1_CS/UART3_TX/PA_EINT13) U$35.P$10(CS/SHDN) ; also sheet 2
PA14: U1.G12(PA14/SPI1_CLK/UART3_RX/PA_EINT14) U$35.P$13(CLK) ; also sheet 2
PA15: U1.F14(PA15/SPI1_MOSI/UART3_RTS/PA_EINT15) U$35.P$11(DIN) ; also sheet 2
PA16: U1.D15(PA16/SPI1_MISO/UART3_CTS/PA_EINT16) U$35.P$12(DOUT) ; also sheet 2
PA17: U1.C14(PA17/SPDIF_OUT(OWA_OUT)/PA_EINT17) ; also sheet 2
PA19: U1.B14(PA19/PCM0_CLK/TWI1_SDA/PA_EINT19) ; also sheet 2
PA20: U1.A13(PA20/PCM0_DOUT/SIM_VPPEN/PA_EINT20) ; also sheet 2
PA21: U1.A14(PA21/PCM0_DIN/SIM_VPPPP/PA_EINT21) ; also sheet 2
PC0: U1.C15(PC0/NAND_WE/SPI0_MOSI) ; also sheet 2
PC1: U1.C16(PC1/NAND_ALE/SPI0_MISO) ; also sheet 2
PC2: U1.B16(PC2/NAND_CLE/SPI0_CLK) ; also sheet 2
PC3: U1.B15(PC3/NAND_CE1/SPI0_CS) ; also sheet 2
PC4: U1.H16(PC16/NAND_DQS/SDC2_RST) ; also sheet 2
PC5: U1.A17(PC5/NAND_RE/SDC2_CLK) U$33.P$2 ; also sheet 2
PC6: U1.E16(PC6/NAND_RB0/SDC2_CMD) ; also sheet 2
PC7: U1.A16(PC7/NAND_RB1) ; also sheet 2
PC9: U1.C17(PC9/NAND_DQ1/SDC2_D1) ; also sheet 2
PC10: U1.D17(PC10/NAND_DQ2/SDC2_D2) ; also sheet 2
PC14: U1.F17(PC14/NAND_DQ6/SDC2_D6) ; also sheet 2
PC16: U1.F16(PC4/NAND_CE0) ; also sheet 2
PE3: U1.C10(PE3/CSI_VSYNC/TS_DVLD) ; also sheet 2
PL5/VCC-IO-EN: FET3.1(G) R81.1 U1.R2(PL5/S_JTAG_CK/S_PL_EINT5)
PWR-DRAM [pwr]: R4.2 U1.M6(PL9/S_PL_EINT9) U57.22(EN3)
PWR-STB [pwr]: R5.2 U1.T2(PL8/S_PL_EINT8) U57.9(EN2) U57.10(EN1)
R0: FPC54P.28(R0) U$23.43(B0/G3)
R1: FPC54P.29(R1) U$23.44(B1/G2)
R2: FPC54P.30(R2) U$23.45(B2/G1)
R3: FPC54P.31(R3) U$23.46(B3/G0)
R4: FPC54P.32(R4) U$23.47(B4/R7)
R5: FPC54P.33(R5) U$23.48(B5/R6)
R6: FPC54P.34(R6) U$23.49(B6/R5)
R7: FPC54P.35(R7) U$23.50(B7/R4)
S0BA0: U1.W17(SBA0) U2.M2(BA0) U3.M2(BA0)
S0BA1: U1.T18(SBA1) U2.N8(BA1) U3.N8(BA1)
S0BA2: U1.V17(SBA2) U2.M3(BA2) U3.M3(BA2)
S0CASN: U1.U15(SCAS) U2.K3(#CAS) U3.K3(#CAS)
S0CKE0: U1.AA21(SCKE0) U2.K9(CKE) U3.K9(CKE)
S0CKE1: U1.Y21(SCKE1) U2.J9(NC) U3.J9(NC)
S0CLK: DR8.2 U1.AA19(SCK) U2.J7(CK) U3.J7(CK)
S0CLKN: DR8.1 U1.AA20(SCKB) U2.K7(#CK) U3.K7(#CK)
S0DDR3_RST: U1.U16(SRST) U2.T2(#RESET) U3.T2(#RESET)
S0DQ0: U1.N20(SDQ0) U2.F8(DQL3)
S0DQ1: U1.P21(SDQ1) U2.H8(DQL5)
S0DQ2: U1.P20(SDQ2) U2.F7(DQL1)
S0DQ3: U1.U21(SDQ3) U2.E3(DQL0)
S0DQ4: U1.R19(SDQ4) U2.H7(DQL7)
S0DQ5: U1.T20(SDQ5) U2.F2(DQL2)
S0DQ6: U1.U19(SDQ6) U2.H3(DQL4)
S0DQ7: U1.U20(SDQ7) U2.G2(DQL6)
S0DQ8: U1.J19(SDQ8) U2.D7(DQU0)
S0DQ9: U1.H20(SDQ9) U2.C8(DQU2)
S0DQ10: U1.H21(SDQ10) U2.B8(DQU6)
S0DQ11: U1.J21(SDQ11) U2.A7(DQU4)
S0DQ12: U1.L20(SDQ12) U2.C3(DQU1)
S0DQ13: U1.L21(SDQ13) U2.C2(DQU3)
S0DQ14: U1.M21(SDQ14) U2.A2(DQU5)
S0DQ15: U1.M19(SDQ15) U2.A3(DQU7)
S0DQ16: U1.Y17(SDQ16) U3.F8(DQL3)
S0DQ17: U1.AA17(SDQ17) U3.H8(DQL5)
S0DQ18: U1.Y16(SDQ18) U3.H7(DQL7)
S0DQ19: U1.W15(SDQ19) U3.F7(DQL1)
S0DQ20: U1.Y14(SDQ20) U3.E3(DQL0)
S0DQ21: U1.AA14(SDQ21) U3.G2(DQL6)
S0DQ22: U1.Y13(SDQ22) U3.H3(DQL4)
S0DQ23: U1.Y12(SDQ23) U3.F2(DQL2)
S0DQ24: U1.W12(SDQ24) U3.C8(DQU2)
S0DQ25: U1.AA11(SDQ25) U3.B8(DQU6)
S0DQ26: U1.Y11(SDQ26) U3.A7(DQU4)
S0DQ27: U1.Y10(SDQ27) U3.D7(DQU0)
S0DQ28: U1.W9(SDQ28) U3.C3(DQU1)
S0DQ29: U1.AA8(SDQ29) U3.C2(DQU3)
S0DQ30: U1.Y8(SDQ30) U3.A3(DQU7)
S0DQ31: U1.Y7(SDQ31) U3.A2(DQU5)
S0ODT0: U1.W11(SODT0) U2.K1(ODT) U3.K1(ODT)
S0ODT1: U1.V11(SODT1) U2.J1(NC) U3.J1(NC)
S0RASN: U1.V13(SRAS) U2.J3(#RAS) U3.J3(#RAS)
S0SA0: U1.T17(SA0) U2.N3(A0) U3.N3(A0)
S0SA1: U1.U18(SA1) U2.P7(A1) U3.P7(A1)
S0SA2: U1.V19(SA2) U2.P3(A2) U3.P3(A2)
S0SA3: U1.V20(SA3) U2.N2(A3) U3.N2(A3)
S0SA4: U1.V21(SA4) U2.P8(A4) U3.P8(A4)
S0SA5: U1.Y19(SA5) U2.P2(A5) U3.P2(A5)
S0SA6: U1.Y20(SA6) U2.R8(A6) U3.R8(A6)
S0SA7: U1.V15(SA7) U2.R2(A7) U3.R2(A7)
S0SA8: U1.W18(SA8) U2.T8(A8) U3.T8(A8)
S0SA9: U1.Y18(SA9) U2.R3(A9) U3.R3(A9)
S0SA10: U1.P19(SA10) U2.L7(A10/AP) U3.L7(A10/AP)
S0SA11: U1.N19(SA11) U2.R7(A11) U3.R7(A11)
S0SA12: U1.R18(SA12) U2.N7(A12/#BC) U3.N7(A12/#BC)
S0SA13: U1.V12(SA13) U2.T3(A13) U3.T3(A13)
S0SA14: U1.N17(SA14) U2.T7(NC/A14) U3.T7(NC/A14)
S0SA15: U1.R17(SA15) U2.M7(NC) U3.M7(NC)
S0SCS0: U1.W20(SCS0) U2.L2(#CS) U3.L2(#CS)
S0SCS1: U1.W21(SCS1) U2.L1(NC) U3.L1(NC)
S0SDQM0: U1.M20(SDQM0) U2.E7(DML)
S0SDQM1: U1.G20(SDQM1) U2.D3(DMU)
S0SDQM2: U1.AA18(SDQM2) U3.E7(DML)
S0SDQM3: U1.AA12(SDQM3) U3.D3(DMU)
S0SDQS0: U1.R20(SDQS0) U2.F3(DQSL)
S0SDQS0_N: U1.R21(SDQS0B) U2.G3(#DQSL)
S0SDQS1: U1.K20(SDQS1) U2.C7(DQSU)
S0SDQS1_N: U1.J20(SDQS1B) U2.B7(#DQSU)
S0SDQS2: U1.AA15(SDQS2) U3.F3(DQSL)
S0SDQS2_N: U1.Y15(SDQS2B) U3.G3(#DQSL)
S0SDQS3: U1.AA9(SDQS3) U3.C7(DQSU)
S0SDQS3_N: U1.Y9(SDQS3B) U3.B7(#DQSU)
S0VREF: DC1.2 DC19.2 DC20.2 DC21.2 DC22.2 R3.2 R9.1 U1.T16(SVREF) U2.H1(VREFDQ) U2.M8(VREFCA) U3.H1(VREFDQ) U3.M8(VREFCA)
S0WEN: U1.W13(SWE) U2.L3(#WE) U3.L3(#WE)
SCL: PSCL.1(PP) U$23.61(RXD_SCL)
SD0-CLK: R22.2 U1.D20(PF2/SDC0_CLK/UART0_TX)
SD0-CMD: MICRO_SD.3(CMD/DI) R20.1 U1.F18(PF3/SDC0_CMD/JTAG_DO0)
SD0-D0: MICRO_SD.7(DAT0/DO) U1.A19(PF1/SDC0_D0/JTAG_DI0)
SD0-D1: MICRO_SD.8(DAT1/RES) U1.D19(PF0/SDC0_D1/JTAG_MS0)
SD0-D2: MICRO_SD.1(DAT2/RES) U1.C20(PF5/SDC0_D2/JTAG_CK0)
SD0-D3: MICRO_SD.2(CD/DAT3/CS) U1.E21(PF4/SDC0_D3/UART0_RX)
SD0-DET#: MICRO_SD.9(CP_E) R16.1 U1.G18(PF6/SDC0_DET)
SD_VCC: C67.2 L1.2 MICRO_SD.4(VDD)
SDA: PSDA.1(PP) U$23.60(TXD_SDA)
SPI_CLK: U$18.6(SCK) U$23.20(SPI_CLK)
SPI_CS: U$18.1(CE#) U$23.17(SPI_CS)
SPI_SI: U$18.2(SO) U$23.18(SPI_SI)
SPI_SO: U$18.5(SI) U$23.19(SPI_SO)
TVOUT: C12.2 JP1.1 L7.1 R77.2 TP7.1(PP) U1.F10(TVOUT)
UDM0: U1.B5(USB_DM0) USB2.1.2
UDM1: U1.B7(USB_DM1) USB2.2.2
UDM2: U1.A8(USB_DM2) USB1.1.2
UDM3: U1.B9(USB_DM3) USB1.2.2
UDP0: U1.A5(USB_DP0) USB2.1.3
UDP1: U1.B6(USB_DP1) USB2.2.3
UDP2: U1.A7(USB_DP2) USB1.1.3
UDP3: U1.B8(USB_DP3) USB1.2.3
V+: 1.5V.1(PP) C107.1 C108.1 C109.1 DC1.1 DC2.1 DC3.1 DC4.2 DC5.2 DC6.2 DC7.1 DC8.1 DC10.2 DC11.2 DC12.2 DC14.1 DC15.2 DC16.2 DC17.2 DC23.2 DC24.2 DC25.2 DC26.1 DC27.2 L6.2 R3.1 R61.1 U1.L16(VCC-DRAM) U1.M16(VCC-DRAM) U1.N16(VCC-DRAM) U1.P16(VCC-DRAM) U1.P17(VCC-DRAM) U1.R16(VCC-DRAM) U1.T12(VCC-DRAM) U1.T13(VCC-DRAM) U1.T14(VCC-DRAM) U1.T15(VCC-DRAM) U1.U11(VCC-DRAM) U2.A1(VDDQ) U2.A8(VDDQ) U2.B2(VDD) U2.C1(VDDQ) U2.C9(VDDQ) U2.D2(VDDQ) U2.D9(VDD) U2.E9(VDDQ) U2.F1(VDDQ) U2.G7(VDD) U2.H2(VDDQ) U2.H9(VDDQ) U2.K2(VDD) U2.K8(VDD) U2.N1(VDD) U2.N9(VDD) U2.R1(VDD) U2.R9(VDD) U3.A1(VDDQ) U3.A8(VDDQ) U3.B2(VDD) U3.C1(VDDQ) U3.C9(VDDQ) U3.D2(VDDQ) U3.D9(VDD) U3.E9(VDDQ) U3.F1(VDDQ) U3.G7(VDD) U3.H2(VDDQ) U3.H9(VDDQ) U3.K2(VDD) U3.K8(VDD) U3.N1(VDD) U3.N9(VDD) U3.R1(VDD) U3.R9(VDD) ; supply symbol labelled 1.5V
VBAT: C92.2 C98.2 C99.2 C100.2 C101.2 C102.2 C118.1 C122.2 C154.2 C155.2 JP2.1 L5.P$1 L14.1 P5.1(PP) R154.1 RLED-1.2 RLED-2.2 U1-A.6(VDD) U16.4(EN) U16.5(IN) U57.3(VCC) U57.8(VIN2) U57.11(VIN1) U57.20(VIN4) U57.23(VIN3) U$11.D1(D) U$11.D2(D) U$14.6(VIN) U$35.P$3(CH2) VR1.1(VIN) VR1.3(CE)
VBUS: C66.2 D7.1(C) D8.1(C) R11-C.1 R120.1 RLED-3.2 RLED-4.1 RLED-5.2 TP12.1(PP) U4.P$3(SEL) U4.P$4(PROG2) U4.P$9(/TE) U4.P$17(CE) U4.P$18(VIN1) U4.P$19(VIN2)
VCC [pwr]: 3.3V.1(PP) C3.1 C60.1 C61.2 C70.2 C71.2 C88.2 C97.2 C105.1 C112.1 C113.1 C135.2 C137.2 C138.2 C143.2 CON1.AG CON1.AY D2.A FET1.1(G) FPC54P.41(VCC) FPC54P.42(VCC2) JOYSTICK_CON.1 L1.1 L4.2 P3.3V.1(PP) R10.1 R12.2 R16.2 R20.2 R26.2 R43.2 R74.1 R92.1 R93.1 R94.1 R96.1 R100.1 R104.1 R105.1 R106.1 R109.1 U1.G7(EPHY_VCC) U1.G10(VDD_EFUSE) U1.G11(VCC_USB) U1.G13(VCC_IO) U1.G14(VCC_IO) U1.G15(VCC_IO) U1.H7(VCC_PG) U1.H13(VCC_IO) U1.H14(VCC_IO) U1.J6(HVCC) U1.J14(VCC_IO) U1.J15(VCC_PD) U$18.3(WP#) U$18.7(HOLD#) U$18.8(VCC) U$23.10(DVDD1) U$23.21(DVDD2) U$23.40(DVDD3) U$23.62(DVDD4) U$35.P$15(VREF) U$35.P$16(VDD) UART0-DBG.5 V_OUT.3 ; supply symbol labelled 3.3V ; also sheet 2
VCC/2: 1.3V.1(PP) C53.1 C54.1 C55.2 C121.2 C129.1 C130.1 L11.2 U1.N8(VDD_CPUX) U1.P6(VDD_CPUX) U1.P7(VDD_CPUX) U1.P8(VDD_CPUX) U1.P9(VDD_CPUX) U1.R6(VDD_CPUX) U1.R7(VDD_CPUX) U1.R8(VDD_CPUX) U1.T6(VDD_CPUX) U1.T7(VDD_CPUX) U1.T8(VDD_CPUX) U1.U6(VDD_CPUX) U1.U9(VDD_CPUX) ; supply symbol labelled 1.3V_CPU
VCCINT: C58.1 C59.2 C69.1 U1.J7(VDD_CPUS) U1.J8(VDD_CPUS) U1.M4(RTC_VIO) ; supply symbol labelled 1.1V_CPUS
VDD: 1.2V.1(PP) C28.1 C29.2 C30.2 C31.2 C115.1 C116.1 C117.1 C125.2 L8.2 R67.1 U1.F8(EPHY_VDD) U1.H10(VDD_SYS) U1.J10(VDD_SYS) U1.J11(VDD_SYS) U1.J12(VDD_SYS) U1.K10(VDD_SYS) U1.K11(VDD_SYS) U1.K12(VDD_SYS) U1.L10(VDD_SYS) U1.L11(VDD_SYS) U1.L12(VDD_SYS) U1.L13(VDD_SYS) U1.L14(VDD_SYS) ; supply symbol labelled 1.2V_SYS
VDD-CPUFB: C65.1 R80.2 TP1.1(PP) U1.T10(VDD_CPUFB)
VDD_AV: C110.2 C139.2 C140.2 U$23.12(VDD_1.2V1) U$23.22(VDD_1.2V2) U$23.41(VDD_1.2V3)
VDD_EFUSEBP: C68.1 U1.H11(VDD_EFUSEBP)
VLIPO: C64.2 U4.P$14(VBAT1) U4.P$15(VBAT2) U4.P$16(VBATSENS) U$8.P$1(GND)
VO+: C147.2 FB1-A.2 TP15.1(PP) U$29.VCC
VO-: C146.2 FB2-A.2 TP16.1(PP) U$29.GND
VPP [pwr]: C1.1 C2.2 C73.2 C74.2 C119.1 C120.1 FET3.2(S) R7.2 R25.2 U1.G9(V33_TV) U1.N3(VCC_PLL) U1.V3(AVCC) VR1.5(VOUT) ; supply symbol labelled 3.3VA
VRX: JOYSTICK_CON.4 U$35.P$2(CH1)
VRY: JOYSTICK_CON.2 U$35.P$1(CH0)
VS: FPC54P.37(VSYNC) U$23.54(VS/R0)
WIFI-POWER-EN: JP15.1 R105.2 U1.T3(PL7/S_JTAG_DI/S_PL_EINT7)
WIFI_EN: JP14.1 R104.2 U1.N1(PL0/S_TWI_SCK/S_PL_EINT0)
WL-SDIO-CLK: JP8.1 R109.2 U1.J3(PG0/SDC1_CLK/PG_EINT0)
WL-SDIO-CMD: JP9.1 R92.2 U1.L2(PG1/SDC1_CMD/PG_EINT1)
WL-SDIO-D0: JP10.1 R93.2 U1.H4(PG2/SDC1_D0/PG_EINT2)
WL-SDIO-D1: JP11.1 R94.2 U1.F3(PG3/SDC1_D1/PG_EINT3)
WL-SDIO-D2: JP12.1 R96.2 U1.C2(PG4/SDC1_D2/PG_EINT4)
WL-SDIO-D3: JP13.1 R100.2 U1.C1(PG5/SDC1_D3/PG_EINT5)
WL-WAKE-HOST: JP16.1 R106.2 U1.F11(PA11/TWI0_SCK/DI_TX/PA_EINT11)
X32KFOUT: U1.P3(X32KFOUT)
X_IN: C142.2 R30.2 U$23.15(X_IN) XL2AMT.1
X_OUT: C141.2 R30.1 U$23.14(X_OUT) XL2AMT.2
XTALI: C81.2 Q1.P$3 U1.K2(X24MIN)
XTALO: C82.2 Q1.P$1 U1.K1(X24MOUT)
Unconnected: CON1.6(NC) FPC54P.5(NC) FPC54P.6(NC1) FPC54P.7(NC2) FPC54P.39(NC3) FPC54P.40(NC4) FPC54P.43(NC5) FPC54P.44(NC6) FPC54P.45(NC7) FPC54P.46(NC8) FPC54P.47(NC9) HDMI.14 U1-A.2(NC) U1.A10(PE1/CSI_MCLK/TS_ERR) U1.A11(PE11/CSI_D7/TS_D7) U1.B1(PG13/PCM1_DIN/PG_EINT13) U1.B10(PE0/CSI_PCLK/TS_CLK) U1.B11(PE2/CSI_HSYNC/TS_SYNC) U1.B12(PE12/CSI_SCK/TWI2_SCK) U1.B13(PA18/PCM0_SYNC/TWI1_SCK/PA_EINT18) U1.B17(PC12/NAND_DQ4/SDC2_D4) U1.B18(PC8/NAND_DQ0/SDC2_D0) U1.B19(PC13/NAND_DQ5/SDC2_D5) U1.B20(PD2/RGMII_RXD1/MII_RXD1/RMII_RXD1) U1.C3(PG8/UART1_RTS/PG_EINT8) U1.C5(PE15) U1.C6(PE14) U1.C7(PE13/CSI_SDA/TWI2_SDA) U1.C8(PE7/CSI_D3/TS_D3) U1.C9(PE4/CSI_D0/TS_D0) U1.C11(PE8/CSI_D4/TS_D4) U1.C12(PE9/CSI_D5/TS_D5) U1.C13(PA12/TWI0_SDA/DI_RX/PA_EINT12) U1.C18(PC11/NAND_DQ3/SDC2_D3) U1.C19(PC15/NAND_DQ7/SDC2_D7) U1.D1(PG12/PCM1_DOUT/PG_EINT12) U1.D2(PG11/PCM1_CLK/PG_EINT11) U1.D3(PG7/UART1_RX/PG_EINT7) U1.D8(PA7/SIM_CLK/PA_EINT7) U1.D10(PE6/CSI_D2/TS_D2) U1.D13(PA9/SIM_RST/PA_EINT9) U1.E3(PG9/UART1_CTS/PG_EINT9) U1.E8(PE10/CSI_D6/TS_D6) U1.E10(PE5/CSI_D1/TS_D1) U1.E11(PA10/SIM_DET/PA_EINT10) U1.E13(PA3/UART2_CTS/JTAG_DI0/PA_EINT3) U1.F13(PA8/SIM_DATA/PA_EINT8) U1.G4(PG6/UART1_TX/PG_EINT6) U1.K4(NC) U1.L5(PLLTEST) U1.M1(PL1/S_TWI_SDA/S_PL_EINT1) U1.M3(PG10/PCM1_SYNC/PG_EINT10) U1.N2(PL4/S_JTAG_MS/S_PL_EINT4) U1.P2(PL2/S_UART_TX/S_PL_EINT2) U1.R1(PL3/S_UART_RX/S_PL_EINT3) U1.T5(TEST) U1.U2(PL11/S_CIR_RX/S_PL_EINT11) U1.V2(PL10/S_PWM/S_PL_EINT10) U16.6(NC) U$17.D+ U$17.D- U$17.ID U$23.6(REMOTE/P03) U$23.7(AD2/P02)

### Buses
S0SA[0..14]
S0DQ[0..31]
S0BA[0..2],S0CLK,S0CLKN,S0CKE0,S0CKE1,S0CASN,S0RASN,S0WEN,S0SDQM[0..3],S0SDQS[0..3],S0SDQS0_N,S0SDQS1_N,S0SDQS2_N,S0SDQS3_N,S0DDR3_RST,S0ODT0,S0ODT1,S0SCS0,S0SCS1,S0SA15
HTX0P,HTX0N,HTX1P,HTX1N,HTX2P,HTX2N,HTXCP,HTXCN,HSCL,HSDA,HHPD,HCEC
UDP[0..3],UDM[0..3],+5V_OTG_PWR
EPHY_LINK_LED,EPHY_SPD_LED,EPHY_TXP,EPHY_TXN,EPHY_RXP,EPHY_RXN

### Notes on the sheet
- DDR3
- Options: | =======
- 1. Use 2(DDR3 256Mx16 Memory chips)x4Gb = 1GByte, 
  i.e. 2xH5TQ4G63MFR-PBC(or K4B4G1646D-BCK0)  -> Default
- 2. Use 2(DDR3 512Mx16 Memory chips)x8Gb = 2GBytes, 
  i.e. 2xH5TC8G63AMR-PBA(or K4B8G1646Q-MYK0)
- Audio
- NOTE: For the best power on/off pop
  performance, the amplifier should be set in the
  shutdown mode prior to power on/off operation
  (set SD low to power down the amp).
- ToDo: Ferrite (select w/high Z at high F,
  low Z at low F). Try to block everything
  >1MHz or so.
- C3: Use 1uF to filter high frequency noise,
  or 10uF if lower frequency noise is present
- Composite video
- Opt out
- Debug UART
- ???
- MicroSD
- wiring OK R20 10k ici 47k opi. OK
- wiring OK revoir R50-R83
- HDMI | Ethernet
- wiring OK
- MODE
- PWRON/WORK | STANDBY | PWROFF
- STATE
- PWR-STB | 1 | 0 | 0
- PWR-DRAM | 1 | 1 | 0
- USB
- POWER SUPPLY CIRCUIT
- =======================
- The power options are:
- Iset = 6800/Rs | Rs
- ======================= | Iset = 13k 523mA-> 10k 680mA
- 1. 3.7V Battery
- 2. 3.5-5V on VBat if not battery
- 3. 5V by microUSB if no battery
- 4. 5V by energysquare pins
- On/Off Switch
  GND=ON
- 3A
- Rg
- Rh
- RDSon 2.5V = 70mOhm
- Vout = 0.6*(1+Re/Rf)
  Re=150k
  VDRAM=1.5V/1A,Rf=100K-1%
  VDRAM=1.35V/1A,Rf=120K-1%
  (Olinuxino : 4.99k/3.32k)
- CPUX-VSET=1,1.3V
  CPUX-VSET=0,1.1V
- Re
- 0.8A
- Charge Rate = 1000V/PROG1 | Re
- Sur A13
  SY8008C
  Sur opi0 
  SY8008B
- 1.0K = 1000mA
- 2.0K = 500mA
- 2A
- Rf | Rf
- Sur A13
  SY8008C
  Sur opi0 
  SY8008B
- Rc
- Or 100k/100k
- PWR-IO = 1 ---> OFF
  PWR-IO = 0 ---> ON
  Make sure that VCC-IO is
  ON when Power up!!
- Rd
- Vout=0.6x(1+Rf/Rd)
- RetroStone Pi

## Sheet 2 of 2
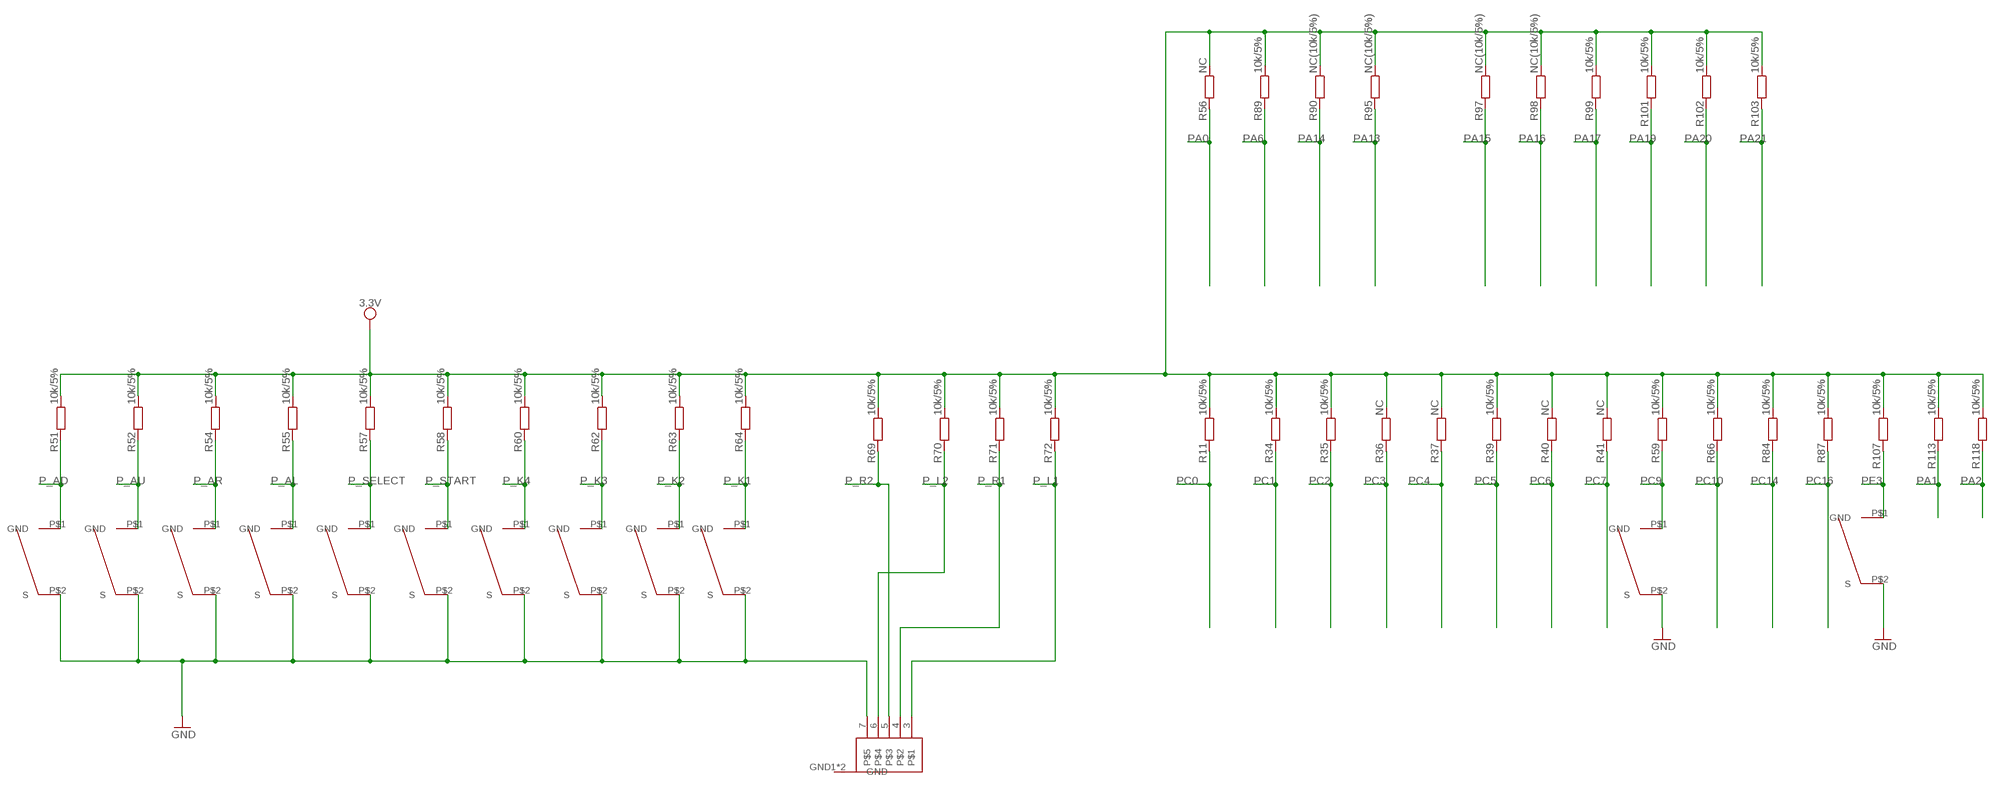
[diagram p5: schematic, sheet 2]

### Parts
AD  PAD_DIRECTION  [PADS_DIRECTION]
AL  PAD_DIRECTION  [PADS_DIRECTION]
AR  PAD_DIRECTION  [PADS_DIRECTION]
AU  PAD_DIRECTION  [PADS_DIRECTION]
K1  PAD_BUTTON  [PAD_BUTTON]
K2  PAD_BUTTON  [PAD_BUTTON]
K3  PAD_BUTTON  [PAD_BUTTON]
K4  PAD_BUTTON  [PAD_BUTTON]
R11  10k/5%  R-EU_R0402_TI  [R0402_TI]
R34  10k/5%  R-EU_R0402_TI  [R0402_TI]
R35  10k/5%  R-EU_R0402_TI  [R0402_TI]
R36  NC  R-EU_R0402_TI  [R0402_TI]
R37  NC  R-EU_R0402_TI  [R0402_TI]
R39  10k/5%  R-EU_R0402_TI  [R0402_TI]
R40  NC  R-EU_R0402_TI  [R0402_TI]
R41  NC  R-EU_R0402_TI  [R0402_TI]
R51  10k/5%  R-EU_R0402_TI  [R0402_TI]
R52  10k/5%  R-EU_R0402_TI  [R0402_TI]
R54  10k/5%  R-EU_R0402_TI  [R0402_TI]
R55  10k/5%  R-EU_R0402_TI  [R0402_TI]
R56  NC  R-EU_R0402_TI  [R0402_TI]
R57  10k/5%  R-EU_R0402_TI  [R0402_TI]
R58  10k/5%  R-EU_R0402_TI  [R0402_TI]
R59  10k/5%  R-EU_R0402_TI  [R0402_TI]
R60  10k/5%  R-EU_R0402_TI  [R0402_TI]
R62  10k/5%  R-EU_R0402_TI  [R0402_TI]
R63  10k/5%  R-EU_R0402_TI  [R0402_TI]
R64  10k/5%  R-EU_R0402_TI  [R0402_TI]
R66  10k/5%  R-EU_R0402_TI  [R0402_TI]
R69  10k/5%  R-EU_R0402_TI  [R0402_TI]
R70  10k/5%  R-EU_R0402_TI  [R0402_TI]
R71  10k/5%  R-EU_R0402_TI  [R0402_TI]
R72  10k/5%  R-EU_R0402_TI  [R0402_TI]
R84  10k/5%  R-EU_R0402_TI  [R0402_TI]
R87  10k/5%  R-EU_R0402_TI  [R0402_TI]
R89  10k/5%  R-EU_R0402_TI  [R0402_TI]
R90  NC(10k/5%)  R-EU_R0402_TI  [R0402_TI]
R95  NC(10k/5%)  R-EU_R0402_TI  [R0402_TI]
R97  NC(10k/5%)  R-EU_R0402_TI  [R0402_TI]
R98  NC(10k/5%)  R-EU_R0402_TI  [R0402_TI]
R99  10k/5%  R-EU_R0402_TI  [R0402_TI]
R101  10k/5%  R-EU_R0402_TI  [R0402_TI]
R102  10k/5%  R-EU_R0402_TI  [R0402_TI]
R103  10k/5%  R-EU_R0402_TI  [R0402_TI]
R107  10k/5%  R-EU_R0402_TI  [R0402_TI]
R113  10k/5%  R-EU_R0402_TI  [R0402_TI]
R118  10k/5%  R-EU_R0402_TI  [R0402_TI]
SELECT  PAD_BUTTON  [PAD_BUTTON]
SELECT3  PAD_BUTTON  [PAD_BUTTON]
SELECT4  PAD_BUTTON  [PAD_BUTTON]
START  PAD_BUTTON  [PAD_BUTTON]
U$4  JST_PH_VERT_5P  [JST_PH_VERT_5P]

### Nets
GND [pwr]: AD.P$2(S) AL.P$2(S) AR.P$2(S) AU.P$2(S) K1.P$2(S) K2.P$2(S) K3.P$2(S) K4.P$2(S) SELECT3.P$2(S) SELECT4.P$2(S) SELECT.P$2(S) START.P$2(S) U$4.7 ; also sheet 1
P_AD: AD.P$1(GND) R51.2 ; also sheet 1
P_AL: AL.P$1(GND) R55.2 ; also sheet 1
P_AR: AR.P$1(GND) R54.2 ; also sheet 1
P_AU: AU.P$1(GND) R52.2 ; also sheet 1
P_K1: K1.P$1(GND) R64.2 ; also sheet 1
P_K2: K2.P$1(GND) R63.2 ; also sheet 1
P_K3: K3.P$1(GND) R62.2 ; also sheet 1
P_K4: K4.P$1(GND) R60.2 ; also sheet 1
P_L1: R72.2 U$4.3 ; also sheet 1
P_L2: R70.2 U$4.6 ; also sheet 1
P_R1: R71.2 U$4.4 ; also sheet 1
P_R2: R69.2 U$4.5 ; also sheet 1
P_SELECT: R57.2 SELECT.P$1(GND) ; also sheet 1
P_START: R58.2 START.P$1(GND) ; also sheet 1
PA0: R56.2 ; also sheet 1
PA1: R113.2 ; also sheet 1
PA2: R118.2 ; also sheet 1
PA6: R89.2 ; also sheet 1
PA13: R95.2 ; also sheet 1
PA14: R90.2 ; also sheet 1
PA15: R97.2 ; also sheet 1
PA16: R98.2 ; also sheet 1
PA17: R99.2 ; also sheet 1
PA19: R101.2 ; also sheet 1
PA20: R102.2 ; also sheet 1
PA21: R103.2 ; also sheet 1
PC0: R11.2 ; also sheet 1
PC1: R34.2 ; also sheet 1
PC2: R35.2 ; also sheet 1
PC3: R36.2 ; also sheet 1
PC4: R37.2 ; also sheet 1
PC5: R39.2 ; also sheet 1
PC6: R40.2 ; also sheet 1
PC7: R41.2 ; also sheet 1
PC9: R59.2 SELECT4.P$1(GND) ; also sheet 1
PC10: R66.2 ; also sheet 1
PC14: R84.2 ; also sheet 1
PC16: R87.2 ; also sheet 1
PE3: R107.2 SELECT3.P$1(GND) ; also sheet 1
VCC [pwr]: R11.1 R34.1 R35.1 R36.1 R37.1 R39.1 R40.1 R41.1 R51.1 R52.1 R54.1 R55.1 R56.1 R57.1 R58.1 R59.1 R60.1 R62.1 R63.1 R64.1 R66.1 R69.1 R70.1 R71.1 R72.1 R84.1 R87.1 R89.1 R90.1 R95.1 R97.1 R98.1 R99.1 R101.1 R102.1 R103.1 R107.1 R113.1 R118.1 ; supply symbol labelled 3.3V ; also sheet 1
Unconnected: U$4.GND1(GND) U$4.GND2(GND)

## Power pins joined to a net without a drawn wire
AD0/P00: U$23.9(AD0/P00)

## Library data of the parts
1.2V 1.3V 1.5V 3.3V P1 P3.3V P5 PGND PSCL PSDA TP1-TP12 TP15 TP16 TP-PD10 TP-PD16 TP-PD17 VCC-RTC = gogo:TESTPAD: drill 40mils, diameter 70mils
AD AL AR AU = raspiboy3:PAD_DIRECTION
C1-C3 C11-C14 C28-C31 C53-C55 C58-C61 C64-C78 C80-C82 C85-C105 C107-C113 C115-C122 C125 C129 C130 C134 C135 C137-C147 C154 C155 DC1-DC8 DC10-DC12 DC14-DC17 DC19-DC27 L7 = rcl:C-EU: CAPACITOR, European symbol
CH3-CH7 JP1-JP18 = pinhead:PINHD-1X1: PIN HEADER
CON1 = OLIMEX_IC:RJLBC-060TC1_GND
D1-D3 D6 = gogo:SCHOTKKY7.62SS
D4 = diode:DIODE-: DIODE
D7-D9 = semicon-smd-ipc:D-: DIODE unfilled
DR2-DR5 DR8 DR9 R1 R2 R2KEY R3 R3KEY R4-R11 R11-C R12 R12-C R13-R18 R18-C R19-R21 R21-C R22-R26 R28-R85 R87-R90 R92-R110 R113 R118 R120 R124 R154 RLED-1-RLED-5 = rcl:R-EU_: RESISTOR, European symbol
ENERGYSQUARE_GND ENERGYSQUARE_VBUS = raspiboy3:CONTACTPIN_ENERGYSQUARE
FB1-A FB2-A = microbuilder:FERRITE: Ferrite Bead 0603 MMZ1608B121C - 120 Ohm @ 100MHz, 600mA, 0.15 Ohm DC Resistance - Digikey: 445-2164-1-ND BK1608HW121-T - 120 Ohm, 600mA Ferrite Chip - Digikey: 587-1876-2-ND 0805 HZ0805B272R-10 - 2.7K Ohm @ 100MHz, 200mA, 0.8 Ohm DC Resistance - Digikey: 240-2504-1-ND (see also Murata BLM21BD272SN1L) MMZ2012Y152B - 1.5K Ohm @ 100MHz, 500mA, 0.4 Ohm DC Resistance - Digikey: 445-1560-1-ND - Mainly for high frequency (80-400MHz) MMZ2012R102A - 1K Ohm @ 100MHz, 500mA, 0.3 Ohm DC Resistance - Digikey: 445-1555-2-ND - More general purpose (10-200MHz)
FET1 FET2 = Penko:N-MOS+DIOD
FET3 = Penko:P-MOS+DIOD
FPC54P = raspiboy:FPC_HAYATO
HDMI = OLIMEX_CONNECTORS:HDMI-MC34931
JOYSTICK_CON = con-lstb:MA04-1: PIN HEADER; OC_FARNELL: unknown; OC_NEWARK: unknown
K1-K4 SELECT SELECT3 SELECT4 START = raspiboy3:PAD_BUTTON
L1-L3 = rcl:L-US: INDUCTOR, American symbol
L4 L6 L8 L11 L14 = OLIMEX_DISCRET:L
L5 = raspiboy3:CD32_INDUCTOR
LED1-LED4 LED5(/PG) = microbuilder:LED: LED 0603 - 0603 Surface Mount Package 2mA: Green LED - Low Power (3.9mcd, 2ma, 1.7Vf) - Digikey: 475-2709-2-ND Orange LED - Low Power (9.8mcd, 2ma, 1.8Vf) - Digikey: 475-1194-2-ND Red LED - Low Power (5mcd, 2ma, 1.8Vf) - Digikey: 475-1195-2-ND Yellow LED - Low Power (7mcd, 2ma, 1.8Vf) - Digikey: 475-1196-2-ND 5mA: Blue LED - Low Power (17mcd, 5ma, 2.9Vf) - Digikey: LNJ937W8CRACT-ND 0805 - 0805 Surface Mount Package 2mA: Red LED (8.8mcd, 2mA, 1.8Vf, Clear) - Low Power [Digikey: 475-2510-1-ND] Green LED (5mcd, 2mA, 1.8Vf, Clear) - Low Power [Digikey: 475-2730-1-ND] Yellow LED (11.3mcd, 2mA, 1.8Vf, Clear) - Low Power [Digikey: 475-2555-1-ND] 20mA: Red LED (104mcd, 20mA, Diffused) - LS R976 [Digikey: 475-1278-6-ND] Red LED (12mcd, 20mA, 2.0Vf, Clear) - APT2012EC [Digikey: 754-1128-1-ND] Green LED (15mcd, 20mA, 2.2Vf, Clear) - APT2012GC [Digikey: 754-1131-1-ND] Orange LED (160mcd, 20mA, 2.1Vf, Clear) - APT2012SECK [Digikey: 754-1130-1-ND] 1206 - 1206 Surface Mount Package Green LED (26mcd, 20mA, Diffused) - LG N971 [Digikey: 475-1407-6-ND] Red LED (15mcd, 20mA, Diffused) - LH N974 [Digikey: 475-1416-6-ND] Cree - Cree High-Power Surface Mount LEDs XPEBWT-L1-0000-00D50 - White 111lm 350mA 2.9Vf 6200K 110° XTEAWT-00-0000-00000LEE3 - White 114lm 350mA 2.85Vf 5000K 115° Everlight - Everlight 45-21 Series Surface Mount LEDs 45-21/QK2C-B2832AC2CB2/2T - Warm White 2000mcd 20mA 3.25Vf 3050K 120° 45-21/LK2C-B38452C4CB2/2T - Nuetral White 2000mcd 20mA 3.25Vf 4150K 120° 45-21/LK2C-B50634C6CB2/2T - Cold White 2200mcd 20mA 3.25Vf 5650K 120° PLCC2 Reverse Mount LS T77K-J1L2-1-0-2-R18-Z - Red 11.25mcd 2mA 1.8Vf 630nm 120° LO T77K-L1M2-24-Z - Orange 19.6mcd 2mA 1.8Vf 606nm 120° LY T77K-K2M1-26-Z - Yellow 15.7mcd 2mA 1.8Vf 587nm 120°
MICRO_SD = OLIMEX_CONNECTORS:MICRO_SD/MMC_CP_NEW
Q1 = raspiboy3:TSX-3225
Q3 = semicon-smd-ipc:NPN-TRANSISTOR_: NPN TRANSISTOR
R27 = OLIMEX_DISCRET:R_0R
U1 = OLIMEX_IC:ALLWINNER-H3
U1-A = microbuilder:AUDIOAMP_PAM8302A: PAM8302A - 2.5W Class-D Mono Audio Amplifier MSOP8 = PAM8302AASCR
U2 U3 = OLIMEX_IC:H5TQ2G63BFR_MEM4G16D3EABG-125
U4 = microbuilder:MCP73871: MCP73871 Lithium Polymer Battery Charger Digikey: MCP73871-2CCI/ML-ND
U5-U7 = OLIMEX_IC:RCLAMP0524P
U8 = OLIMEX_IC:SY6280
U16 = OLIMEX_IC:SY7208
U57 = est-h503s:AXP8036
U$4 = raspiboy3:JST_PH_VERT_5P
U$6 = raspiboy3:SS-12F21(1P2T)
U$8 = raspiboy3:JST_PH_VERT_2P
U$11 = raspiboy3:CSD22205L
U$14 = raspiboy:KA2707
U$15 U$33 U$36-U$38 = raspiboy3:TACT_SWITCH_HORIZONTAL
U$17 = raspiboy3:MICROUSB_HAYATO
U$18 = raspiboy:PM25LV512
U$23 = raspiboy3:AMT630A
U$24 = raspiboy3:PJ342_5PIN
U$27 = raspiboy3:WHEEL_POT
U$29 = raspiboy3:JST2_HAYATO
U$35 = raspiboy3:MCP3208
UART0-DBG V_OUT = Penko:CON5
USB1 USB2 = OLIMEX_IC:USB_TWO_LEVEL
VR1 = OLIMEX_DISCRET:AP1231
XL2AMT = Ai_FrequencyControl:CRYSTAL: PTH: ... SMD: ... Cylinder: CMR200T-32.768KDZBT